# EAGLE design BSB-LAN-Full (EAGLE 6.6.0)
REVISION: v1.1

## Sheet 1 of 4
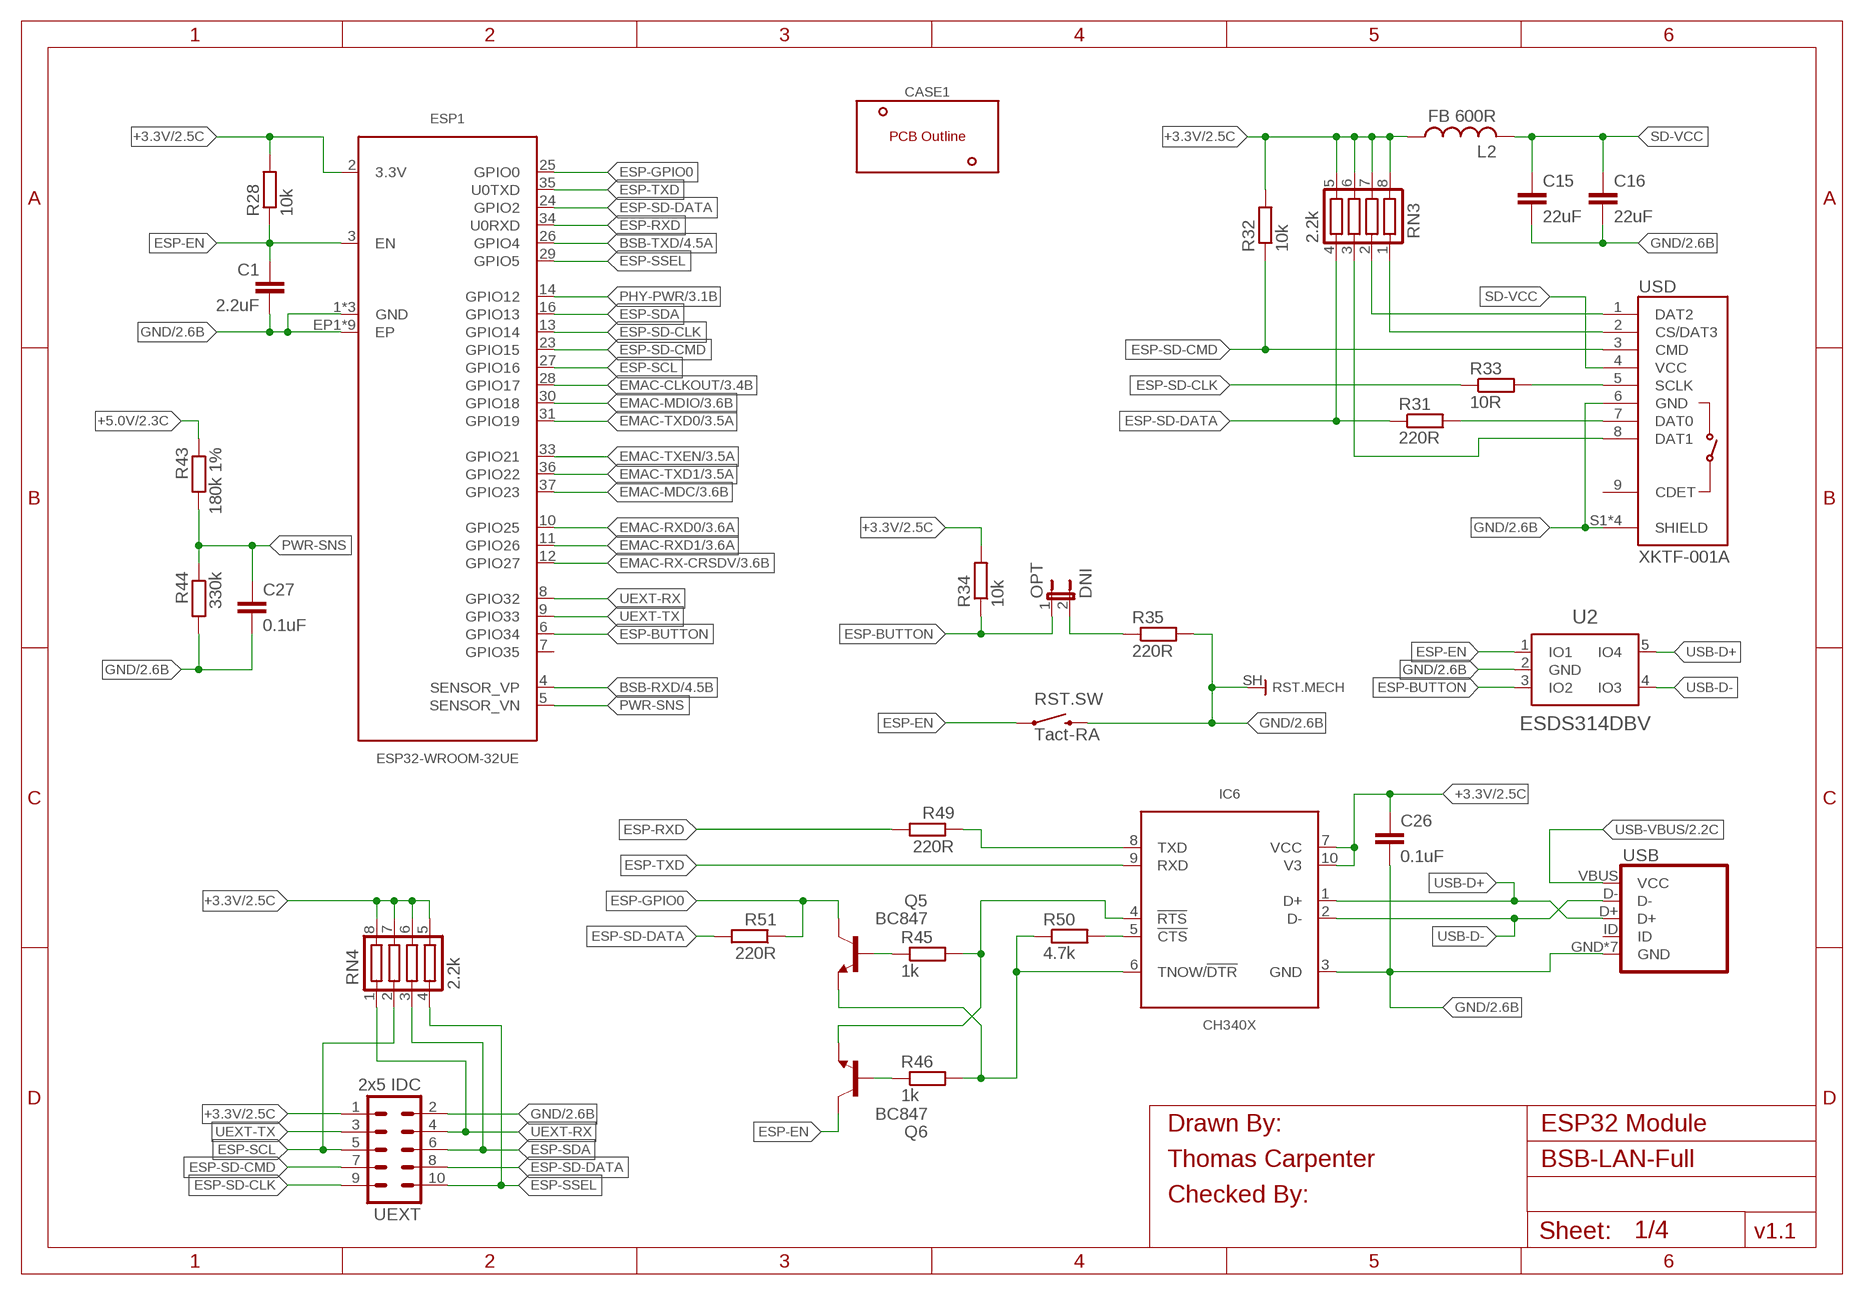
[diagram p0: schematic, sheet 1]
FRAME4 (A4L-LOC): DRAWN_BY: Thomas Carpenter; SHEET_NAME: ESP32 Module

### Parts
C1  2.2uF  C-EUC0603  [C0603]
C15  22uF  C-EUC0805L  [C0805L]
C16  22uF  C-EUC0805L  [C0805L]
C26  0.1uF  C-EUC0603L  [C0603L]
C27  0.1uF  C-EUC0603L  [C0603L]
CASE1  DNI  CNMB/2  [CNMB/2-]
ESP1  ESP32-WROOM-32UE  [ESP32-WROOM-32UE]
IC6  CH340X  [MSOP10]
L2  FB 600R  L-USL0805  [L2010]
OPT  DNI  JUMPER-2-2MM  [1X02-2MM]
Q5  BC847  [SOT23]
Q6  BC847  [SOT23]
R28  10k  R-EU_R0402  [R0402]
R31  220R  R-EU_R0402  [R0402]
R32  10k  R-EU_R0402  [R0402]
R33  10R  R-EU_R0603L  [R0603L]
R34  10k  R-EU_R0402  [R0402]
R35  220R  R-EU_R0402  [R0402]
R43  180k 1%  R-EU_R0402  [R0402]
R44  330k  R-EU_R0603L  [R0603L]
R45  1k  R-EU_R0402  [R0402]
R46  1k  R-EU_R0402  [R0402]
R49  220R  R-EU_R0402  [R0402]
R50  4.7k  R-EU_R0402  [R0402]
R51  220R  R-EU_R0402  [R0402]
RN3  2.2k  R-NET-04-R1206  [CTS742C083]
RN4  2.2k  R-NET-04-R1206  [CTS742C083]
RST  Tact-RA  SWITCH-MOMENTARY-SHELL-SMD-RA  [TACTILE_SWITCH_SMD_SIDE_SHL]
U2  ESDS314DBV  [DBV0005A-SOT23]
UEXT  2x5 IDC  ML10  [ML10]
USB  ZX62-B-5PA(33)  USB_MICROB_PLUG  [USB-MICROB]
USD  XKTF-001A  MICROSD  [MICRO-SD]

### Nets
+3.3V [ESP32]: C26.1 ESP1.2(3.3V) IC6.7(VCC) IC6.10(V3) L2.1 R28.2 R32.2 R34.2 RN3.5 RN3.6 RN3.7 RN3.8 RN4.5 RN4.6 RN4.7 RN4.8 UEXT.1 ; also sheet 2,3,4
+5.0V [ESP32]: R43.1 ; also sheet 2
BSB-RXD [ESP32]: ESP1.4(SENSOR_VP) ; also sheet 4
BSB-TXD [ESP32]: ESP1.26(GPIO4) ; also sheet 4
CH340-!CTS [ESP32]: IC6.5(!CTS) R50.2
CH340-!DTR [ESP32]: IC6.6(TNOW/!DTR) Q5.2(E) R46.2 R50.1
CH340-!RTS [ESP32]: IC6.4(!RTS) Q6.2(E) R45.2
CH340-TXD [ESP32]: IC6.8(TXD) R49.1
EMAC-CLKOUT [ESP32]: ESP1.28(GPIO17) ; also sheet 3
EMAC-MDC [ESP32]: ESP1.37(GPIO23) ; also sheet 3
EMAC-MDIO [ESP32]: ESP1.30(GPIO18) ; also sheet 3
EMAC-RX-CRSDV [ESP32]: ESP1.12(GPIO27) ; also sheet 3
EMAC-RXD0 [ESP32]: ESP1.10(GPIO25) ; also sheet 3
EMAC-RXD1 [ESP32]: ESP1.11(GPIO26) ; also sheet 3
EMAC-TXD0 [ESP32]: ESP1.31(GPIO19) ; also sheet 3
EMAC-TXD1 [ESP32]: ESP1.36(GPIO22) ; also sheet 3
EMAC-TXEN [ESP32]: ESP1.33(GPIO21) ; also sheet 3
ESP-BUTTON [ESP32]: ESP1.6(GPIO34) OPT.1 R34.1 U2.3(IO2)
ESP-BUTTON-R [ESP32]: OPT.2 R35.1
ESP-EN [ESP32]: C1.1 ESP1.3(EN) Q6.3(C) R28.1 RST.1 RST.2 U2.1(IO1)
ESP-GPIO0 [ESP32]: ESP1.25(GPIO0) Q5.3(C) R51.1
ESP-RXD [ESP32]: ESP1.34(U0RXD) R49.2
ESP-SCL [ESP32]: ESP1.27(GPIO16) RN4.2 UEXT.5
ESP-SD-CLK [ESP32]: ESP1.13(GPIO14) R33.1 UEXT.9
ESP-SD-CMD [ESP32]: ESP1.23(GPIO15) R32.1 UEXT.7 USD.3(CMD)
ESP-SD-DATA [ESP32]: ESP1.24(GPIO2) R31.1 R51.2 RN3.4 UEXT.8
ESP-SDA [ESP32]: ESP1.16(GPIO13) RN4.3 UEXT.6
ESP-SSEL [ESP32]: ESP1.29(GPIO5) RN4.4 UEXT.10
ESP-TXD [ESP32]: ESP1.35(U0TXD) IC6.9(RXD)
GND [ESP32]: C1.2 C15.2 C16.2 C26.2 C27.2 ESP1.1(GND) ESP1.15(GND) ESP1.38(GND) ESP1.EP1(EP) ESP1.EP2(EP) ESP1.EP3(EP) ESP1.EP4(EP) ESP1.EP5(EP) ESP1.EP6(EP) ESP1.EP7(EP) ESP1.EP8(EP) ESP1.EP9(EP) IC6.3(GND) R35.2 R44.2 RST.3 RST.4 RST.SH(.MECH:M) U2.2(GND) UEXT.2 USB.GND USB.MT1(GND) USB.MT2(GND) USB.MT3(GND) USB.MT4(GND) USB.MT5(GND) USB.MT6(GND) USD.6(GND) USD.S1(SHIELD) USD.S2(SHIELD) USD.S3(SHIELD) USD.S4(SHIELD) ; also sheet 2,3,4
N$2 [ESP32]: Q5.1(B) R45.1
N$4 [ESP32]: Q6.1(B) R46.1
PHY-PWR [ESP32]: ESP1.14(GPIO12) ; also sheet 3
PWR-SNS [ESP32]: C27.1 ESP1.5(SENSOR_VN) R43.2 R44.1
SD-DAT0 [ESP32]: R31.2 USD.7(DAT0)
SD-DAT1 [ESP32]: RN3.3 USD.8(DAT1)
SD-DAT2 [ESP32]: RN3.2 USD.1(DAT2)
SD-DAT3 [ESP32]: RN3.1 USD.2(CS/DAT3)
SD-SCLK [ESP32]: R33.2 USD.5(SCLK)
SD-VCC [ESP32]: C15.1 C16.1 L2.2 USD.4(VCC)
UEXT-RX: ESP1.8(GPIO32) RN4.1 UEXT.4
UEXT-TX [ESP32]: ESP1.9(GPIO33) UEXT.3
USB-D+ [ESP32]: IC6.1(D+) U2.5(IO4) USB.D+
USB-D- [ESP32]: IC6.2(D-) U2.4(IO3) USB.D-
USB-VBUS [ESP32]: USB.VBUS(VCC) ; also sheet 2
Unconnected: ESP1.7(GPIO35) USB.ID USD.9(CDET)

## Sheet 2 of 4
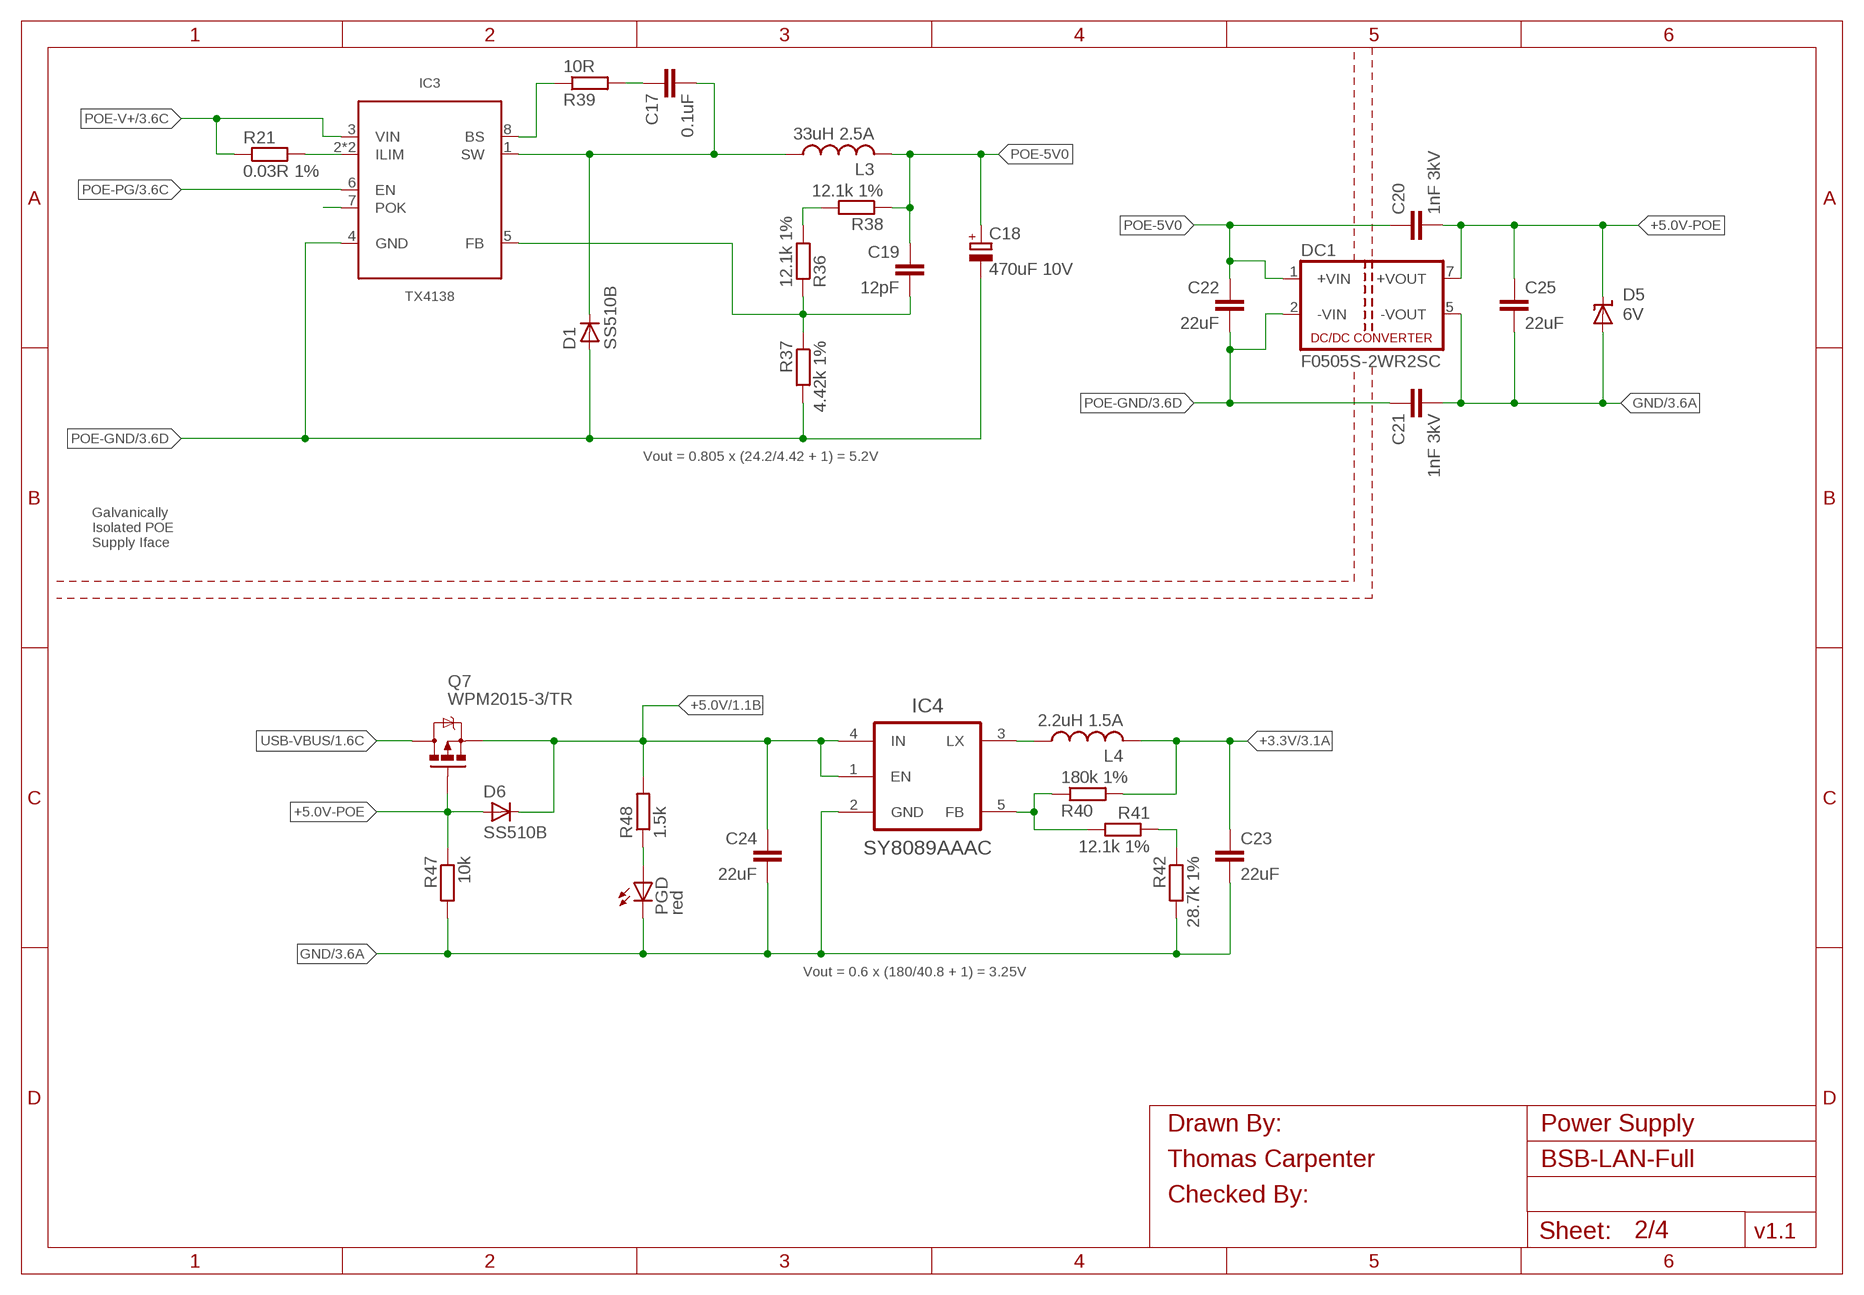
[diagram p1: schematic, sheet 2]
FRAME3 (A4L-LOC): DRAWN_BY: Thomas Carpenter; SHEET_NAME: Power Supply

### Parts
C17  0.1uF  C-EUC0603L  [C0603L]
C18  470uF 10V  CPOL-EUSMCD  [SMC_D]
C19  12pF  C-EUC0402  [C0402]
C20  1nF 3kV  C-EUC1808  [C1808]
C21  1nF 3kV  C-EUC1808  [C1808]
C22  22uF  C-EUC0805  [C0805]
C23  22uF  C-EUC0805  [C0805]
C24  22uF  C-EUC0805  [C0805]
C25  22uF  C-EUC0805  [C0805]
D1  SS510B  DIODE-SMB  [SMB]
D5  6V  TVS-UNISMA  [SMA]
D6  SS510B  DIODE-SMB  [SMB]
DC1  F0505S-2WR2SC  [SIP7-N]
IC3  TX4138  [SOIC8-EP]
IC4  SY8089AAAC  [DBV0005A-SOT23]
L3  33uH 2.5A  L-USL6560P  [L6560P]
L4  2.2uH 1.5A  L-USL4040P  [L4040P]
PGD  red  LEDCHIPLED_0603  [CHIP-LED0603]
Q7  WPM2015-3/TR  [SOT23]
R21  0.03R 1%  R-EU_R1206  [R1206]
R36  12.1k 1%  R-EU_R0402  [R0402]
R37  4.42k 1%  R-EU_R0402  [R0402]
R38  12.1k 1%  R-EU_R0402  [R0402]
R39  10R  R-EU_R0603L  [R0603L]
R40  180k 1%  R-EU_R0402  [R0402]
R41  12.1k 1%  R-EU_R0402  [R0402]
R42  28.7k 1%  R-EU_R0402  [R0402]
R47  10k  R-EU_R0402  [R0402]
R48  1.5k  R-EU_R0603  [R0603]

### Nets
3V3-FB [ESP32]: IC4.5(FB) R40.1 R41.2
3V3-FB-RB [ESP32]: R41.1 R42.1
3V3-LX [ESP32]: IC4.3(LX) L4.1
+3.3V [ESP32]: C23.1 L4.2 R40.2 ; also sheet 1,3,4
+5.0V [ESP32]: C24.1 D6.C IC4.1(EN) IC4.4(IN) Q7.2(S) R48.2 ; also sheet 1
+5.0V-POE [ESP32]: C20.2 C25.1 D5.C D6.A DC1.7(+VOUT) Q7.1(G) R47.1
GND [ESP32]: C21.2 C23.2 C24.2 C25.2 D5.A DC1.5(-VOUT) IC4.2(GND) PGD.C R42.2 R47.2 ; also sheet 1,3,4
POE-5V0 [PoE-ISO]: C18.+ C19.1 C20.1 C22.1 DC1.1(+VIN) L3.2 R38.1
POE-DC-BS [PoE-ISO]: IC3.8(BS) R39.1
POE-DC-BS-RC [PoE-ISO]: C17.1 R39.2
POE-DC-FB [PoE-ISO]: C19.2 IC3.5(FB) R36.1 R37.1
POE-DC-FBRT [PoE-ISO]: R36.2 R38.2
POE-DC-ILIM [PoE-ISO]: IC3.2(ILIM) IC3.EP(ILIM) R21.2
POE-DC-POK-NC [PoE-ISO]: IC3.7(POK)
POE-DC-SW [PoE-ISO]: C17.2 D1.C IC3.1(SW) L3.1
POE-GND [PoE-ISO]: C18.- C21.1 C22.2 D1.A DC1.2(-VIN) IC3.4(GND) R37.2 ; also sheet 3
POE-PG [PoE-ISO]: IC3.6(EN) ; also sheet 3
POE-V+ [PoE-ISO]: IC3.3(VIN) R21.1 ; also sheet 3
PWR-LED [ESP32]: PGD.A R48.1
USB-VBUS [ESP32]: Q7.3(D) ; also sheet 1

### Notes on the sheet
- Vout = 0.805 x (24.2/4.42 + 1) = 5.2V
- Galvanically
  Isolated POE
  Supply Iface
- Vout = 0.6 x (180/40.8 + 1) = 3.25V

## Sheet 3 of 4
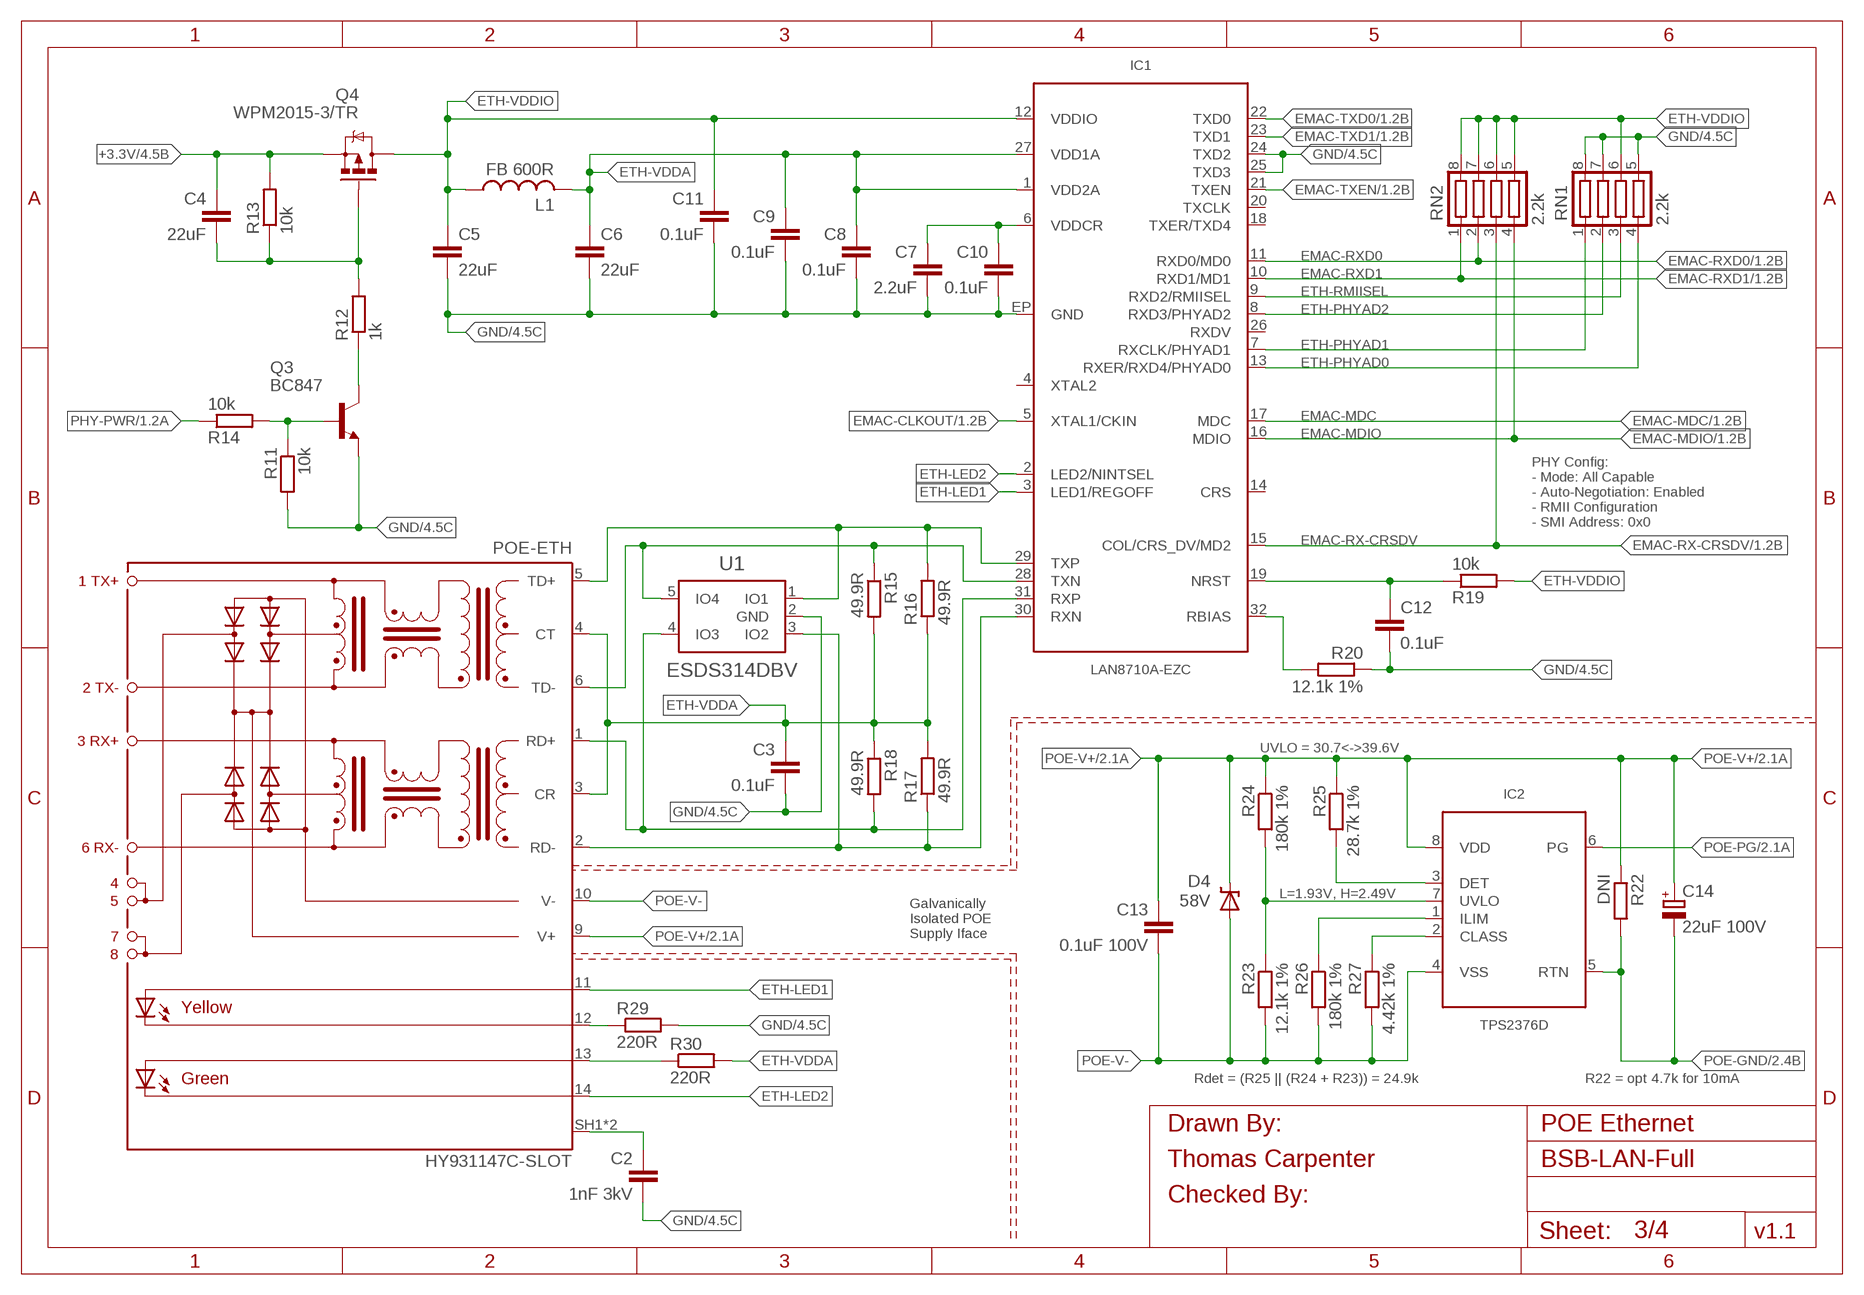
[diagram p2: schematic, sheet 3]
FRAME2 (A4L-LOC): DRAWN_BY: Thomas Carpenter; SHEET_NAME: POE Ethernet

### Parts
C2  1nF 3kV  C-EUC1808  [C1808]
C3  0.1uF  C-EUC0603  [C0603]
C4  22uF  C-EUC0805L  [C0805L]
C5  22uF  C-EUC0805L  [C0805L]
C6  22uF  C-EUC0805L  [C0805L]
C7  2.2uF  C-EUC0603  [C0603]
C8  0.1uF  C-EUC0603L  [C0603L]
C9  0.1uF  C-EUC0603L  [C0603L]
C10  0.1uF  C-EUC0603L  [C0603L]
C11  0.1uF  C-EUC0603L  [C0603L]
C12  0.1uF  C-EUC0603L  [C0603L]
C13  0.1uF 100V  C-EUC0603  [C0603]
C14  22uF 100V  CPOL-EUD  [PANASONIC_D]
D4  58V  TVS-UNISMA  [SMA]
IC1  LAN8710A-EZC  [QFN-5X5-32]
IC2  TPS2376D  [SOIC8]
L1  FB 600R  L-USL0805  [L2010]
POE-ETH  HY931147C-SLOT  [HY931147C-SLOT]
Q3  BC847  [SOT23]
Q4  WPM2015-3/TR  [SOT23]
R11  10k  R-EU_R0402  [R0402]
R12  1k  R-EU_R0402  [R0402]
R13  10k  R-EU_R0402  [R0402]
R14  10k  R-EU_R0402  [R0402]
R15  49.9R  R-EU_R0402L  [R0402L]
R16  49.9R  R-EU_R0402L  [R0402L]
R17  49.9R  R-EU_R0402L  [R0402L]
R18  49.9R  R-EU_R0402L  [R0402L]
R19  10k  R-EU_R0402  [R0402]
R20  12.1k 1%  R-EU_R0402  [R0402]
R22  DNI  R-EU_R1206  [R1206]
R23  12.1k 1%  R-EU_R0402  [R0402]
R24  180k 1%  R-EU_R0402  [R0402]
R25  28.7k 1%  R-EU_R0402  [R0402]
R26  180k 1%  R-EU_R0402  [R0402]
R27  4.42k 1%  R-EU_R0402  [R0402]
R29  220R  R-EU_R0402  [R0402]
R30  220R  R-EU_R0402  [R0402]
RN1  2.2k  R-NET-04-R1206  [CTS742C083]
RN2  2.2k  R-NET-04-R1206  [CTS742C083]
U1  ESDS314DBV  [DBV0005A-SOT23]

### Nets
+3.3V [ESP32]: C4.1 Q4.2(S) R13.2 ; also sheet 1,2,4
EMAC-CLKOUT [ESP32]: IC1.5(XTAL1/CKIN) ; also sheet 1
EMAC-MDC [ESP32]: IC1.17(MDC) ; also sheet 1
EMAC-MDIO [ESP32]: IC1.16(MDIO) RN2.4 ; also sheet 1
EMAC-RX-CRSDV [ESP32]: IC1.15(COL/CRS_DV/MD2) RN2.3 ; also sheet 1
EMAC-RXD0 [ESP32]: IC1.11(RXD0/MD0) RN2.2 ; also sheet 1
EMAC-RXD1 [ESP32]: IC1.10(RXD1/MD1) RN2.1 ; also sheet 1
EMAC-TXD0 [ESP32]: IC1.22(TXD0) ; also sheet 1
EMAC-TXD1 [ESP32]: IC1.23(TXD1) ; also sheet 1
EMAC-TXEN [ESP32]: IC1.21(TXEN) ; also sheet 1
ETH-LED1 [ESP32]: IC1.3(LED1/REGOFF) POE-ETH.11(YA)
ETH-LED1-K [ESP32]: POE-ETH.12(YK) R29.1
ETH-LED2 [ESP32]: IC1.2(LED2/NINTSEL) POE-ETH.14(GK)
ETH-LED-G-A [ESP32]: POE-ETH.13(GA) R30.1
ETH-PHYAD0 [ESP32]: IC1.13(RXER/RXD4/PHYAD0) RN1.4
ETH-PHYAD1 [ESP32]: IC1.7(RXCLK/PHYAD1) RN1.1
ETH-PHYAD2 [ESP32]: IC1.8(RXD3/PHYAD2) RN1.2
ETH-PWR-B [ESP32]: Q3.1(B) R11.1 R14.2
ETH-PWR-C [ESP32]: Q3.3(C) R12.1
ETH-PWR-G [ESP32]: C4.2 Q4.1(G) R12.2 R13.1
ETH-RBIAS [ESP32]: IC1.32(RBIAS) R20.2
ETH-RD_N [100R]: IC1.30(RXN) POE-ETH.2(RD-) R17.1 U1.3(IO2)
ETH-RD_P [100R]: IC1.31(RXP) POE-ETH.1(RD+) R18.2 U1.4(IO3)
ETH-RMIISEL [ESP32]: IC1.9(RXD2/RMIISEL) RN1.3
ETH-RST [ESP32]: C12.1 IC1.19(NRST) R19.1
ETH-SHLD [Sheild]: C2.1 POE-ETH.SH1(SLD) POE-ETH.SH2(SLD)
ETH-TD_N [100R]: IC1.28(TXN) POE-ETH.6(TD-) R15.1 U1.5(IO4)
ETH-TD_P [100R]: IC1.29(TXP) POE-ETH.5(TD+) R16.2 U1.1(IO1)
ETH-VDDA [ESP32]: C3.1 C6.1 C8.1 C9.1 IC1.1(VDD2A) IC1.27(VDD1A) L1.2 POE-ETH.3(CR) POE-ETH.4(CT) R15.2 R16.1 R17.2 R18.1 R30.2
ETH-VDDCR [ESP32]: C7.1 C10.1 IC1.6(VDDCR)
ETH-VDDIO [ESP32]: C5.1 C11.1 IC1.12(VDDIO) L1.1 Q4.3(D) R19.2 RN1.6 RN2.5 RN2.6 RN2.7 RN2.8
GND [ESP32]: C2.2 C3.2 C5.2 C6.2 C7.2 C8.2 C9.2 C10.2 C11.2 C12.2 IC1.24(TXD2) IC1.25(TXD3) IC1.EP(GND) Q3.2(E) R11.2 R20.1 R29.2 RN1.5 RN1.7 RN1.8 U1.2(GND) ; also sheet 1,2,4
PHY-PWR [ESP32]: R14.1 ; also sheet 1
POE-CLASS [PoE-ISO]: IC2.2(CLASS) R27.1
POE-DET [PoE-ISO]: IC2.3(DET) R25.2
POE-GND [PoE-ISO]: C14.- IC2.5(RTN) R22.2 ; also sheet 2
POE-ILIM [PoE-ISO]: IC2.1(ILIM) R26.1
POE-PG [PoE-ISO]: IC2.6(PG) ; also sheet 2
POE-UVLO [PoE-ISO]: IC2.7(UVLO) R23.1 R24.2
POE-V+ [PoE-ISO]: C13.1 C14.+ D4.C IC2.8(VDD) POE-ETH.9(V+) R22.1 R24.1 R25.1 ; also sheet 2
POE-V- [PoE-ISO]: C13.2 D4.A IC2.4(VSS) POE-ETH.10(V-) R23.2 R26.2 R27.2
Unconnected: IC1.4(XTAL2) IC1.14(CRS) IC1.18(TXER/TXD4) IC1.20(TXCLK) IC1.26(RXDV)

### Notes on the sheet
- PHY Config:
  - Mode: All Capable
  - Auto-Negotiation: Enabled
  - RMII Configuration
  - SMI Address: 0x0
- UVLO = 30.7<->39.6V
- L=1.93V, H=2.49V
- Galvanically
  Isolated POE
  Supply Iface
- Rdet = (R25 || (R24 + R23)) = 24.9k | R22 = opt 4.7k for 10mA

## Sheet 4 of 4
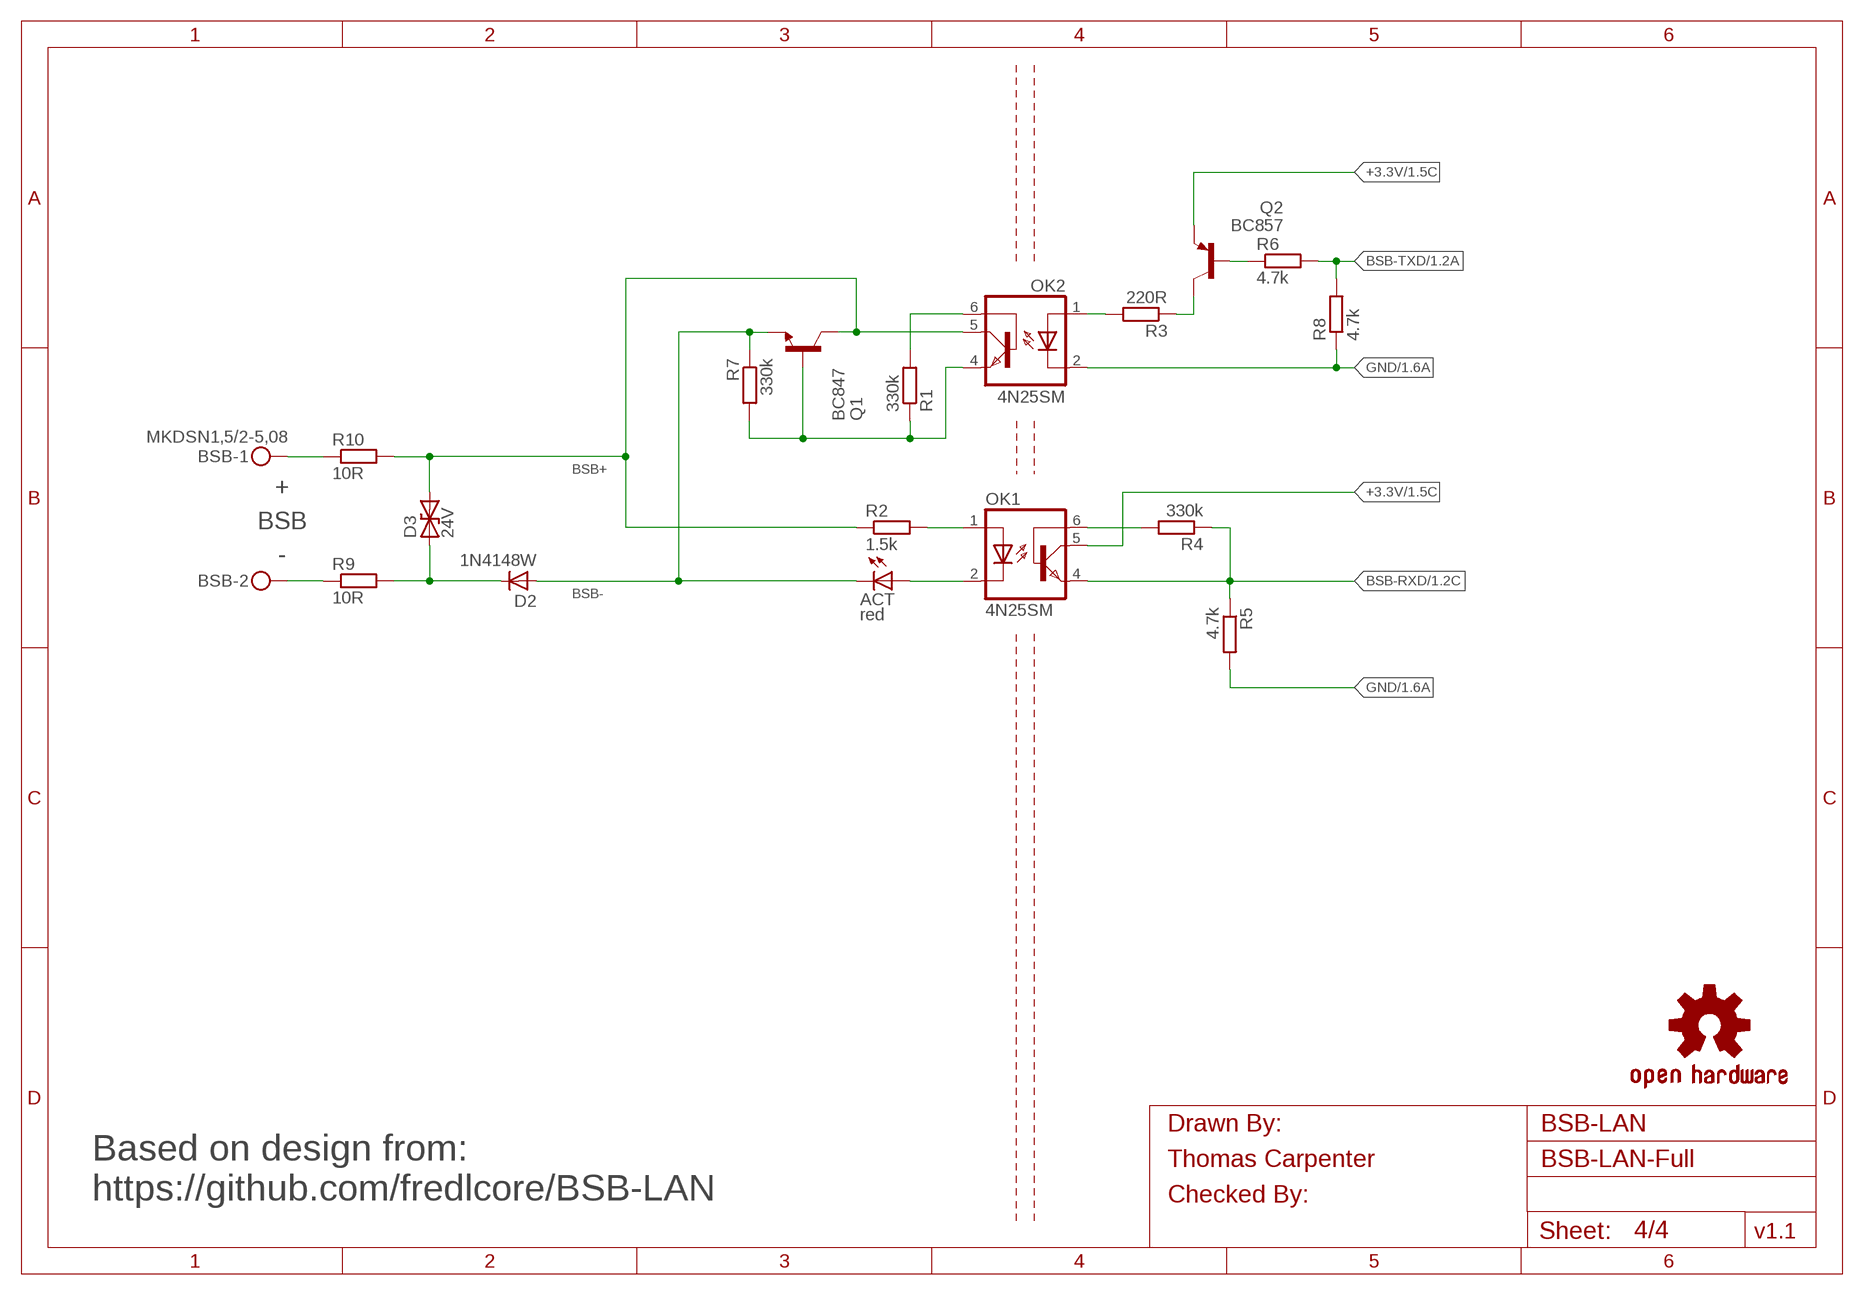
[diagram p3: schematic, sheet 4]
FRAME1 (A4L-LOC): DRAWN_BY: Thomas Carpenter; SHEET_NAME: BSB-LAN

### Parts
ACT  red  LEDCHIPLED_0603  [CHIP-LED0603]
BSB  MKDSN1,5/2-5,08  [MKDSN1_5-2-5_08]
D2  1N4148W  DIODE-SOD123  [SOD123]
D3  24V  TVS-BIDIRSMB  [SMBG]
OK1  4N25SM  [DIL6-SMD]
OK2  4N25SM  [DIL6-SMD]
Q1  BC847  [SOT23]
Q2  BC857  [SOT23-BEC]
R1  330k  R-EU_R0603  [R0603]
R2  1.5k  R-EU_R0603  [R0603]
R3  220R  R-EU_R0402  [R0402]
R4  330k  R-EU_R0603  [R0603]
R5  4.7k  R-EU_R0402  [R0402]
R6  4.7k  R-EU_R0402  [R0402]
R7  330k  R-EU_R0603  [R0603]
R8  4.7k  R-EU_R0402  [R0402]
R9  10R  R-EU_R0603  [R0603]
R10  10R  R-EU_R0603  [R0603]
U$3  DNI  OSHW-LOGOM  [OSHW-LOGO-M]

### Nets
+3.3V [ESP32]: OK1.5(COL) Q2.E ; also sheet 1,2,3
BSB+ [B2B-ISO]: D3.2 OK2.5(COL) Q1.3(C) R2.1 R10.2
BSB- [B2B-ISO]: ACT.C D2.A Q1.2(E) R7.1
BSB-RX-A [B2B-ISO]: OK1.1(A) R2.2
BSB-RX-K [B2B-ISO]: ACT.A OK1.2(C)
BSB-RXD [ESP32]: OK1.4(EMI) R4.1 R5.1 ; also sheet 1
BSB-TX-B [B2B-ISO]: OK2.6(BAS) R1.2
BSB-TX-E [B2B-ISO]: OK2.4(EMI) Q1.1(B) R1.1 R7.2
BSB-TXD [ESP32]: R6.2 R8.2 ; also sheet 1
CON-BSB+ [B2B-ISO]: BSB.1 R10.1
CON-BSB- [B2B-ISO]: BSB.2 R9.1
GND [ESP32]: OK2.2(C) R5.2 R8.1 ; also sheet 1,2,3
RXD-B [ESP32]: OK1.6(BAS) R4.2
TVS-BSB- [B2B-ISO]: D2.C D3.1 R9.2
TXD-A [ESP32]: OK2.1(A) R3.2
TXD-B [ESP32]: Q2.B R6.1
TXD-C [ESP32]: Q2.C R3.1

### Notes on the sheet
- +
  BSB
  -
- Based on design from:
  https://github.com/fredlcore/BSB-LAN

## Library data of the parts
ACT PGD = BSB-LAN:LED: LED OSRAM: - CHIPLED LG R971, LG N971, LY N971, LG Q971, LY Q971, LO R971, LY R971 LH N974, LH R974 LS Q976, LO Q976, LY Q976 LO Q996 - Hyper CHIPLED LW Q18S LB Q993, LB Q99A, LB R99A - SideLED LS A670, LO A670, LY A670, LG A670, LP A670 LB A673, LV A673, LT A673, LW A673 LH A674 LY A675 LS A676, LA A676, LO A676, LY A676, LW A676 LS A679, LY A679, LG A679 - Hyper Micro SIDELED® LS Y876, LA Y876, LO Y876, LY Y876 LT Y87S - SmartLED LW L88C, LW L88S LB L89C, LB L89S, LG L890 LS L89K, LO L89K, LY L89K LS L896, LA L896, LO L896, LY L896 - TOPLED LS T670, LO T670, LY T670, LG T670, LP T670 LSG T670, LSP T670, LSY T670, LOP T670, LYG T670 LG T671, LOG T671, LSG T671 LB T673, LV T673, LT T673, LW T673 LH T674 LS T676, LA T676, LO T676, LY T676, LB T676, LH T676, LSB T676, LW T676 LB T67C, LV T67C, LT T67C, LS T67K, LO T67K, LY T67K, LW E67C LS E67B, LA E67B, LO E67B, LY E67B, LB E67C, LV E67C, LT E67C LW T67C LS T679, LY T679, LG T679 LS T770, LO T770, LY T770, LG T770, LP T770 LB T773, LV T773, LT T773, LW T773 LH T774 LS E675, LA E675, LY E675, LS T675 LS T776, LA T776, LO T776, LY T776, LB T776 LHGB T686 LT T68C, LB T68C - Hyper Mini TOPLED® LB M676 - Mini TOPLED Santana® LG M470 LS M47K, LO M47K, LY M47K Source: http://www.osram.convergy.de LUXEON: - LUMILED® LXK2-PW12-R00, LXK2-PW12-S00, LXK2-PW14-U00, LXK2-PW14-V00 LXK2-PM12-R00, LXK2-PM12-S00, LXK2-PM14-U00 LXK2-PE12-Q00, LXK2-PE12-R00, LXK2-PE12-S00, LXK2-PE14-T00, LXK2-PE14-U00 LXK2-PB12-K00, LXK2-PB12-L00, LXK2-PB12-M00, LXK2-PB14-N00, LXK2-PB14-P00, LXK2-PB14-Q00 LXK2-PR12-L00, LXK2-PR12-M00, LXK2-PR14-Q00, LXK2-PR14-R00 LXK2-PD12-Q00, LXK2-PD12-R00, LXK2-PD12-S00 LXK2-PH12-R00, LXK2-PH12-S00 LXK2-PL12-P00, LXK2-PL12-Q00, LXK2-PL12-R00 Source: www.luxeon.com KINGBRIGHT: KA-3528ASYC Source: www.kingbright.com; JLC_ROT: 270; LCSC_PART: C2286
BSB = BSB-LAN:MKDSN1,5/2-5,08: MKDSN 1,5/ 2-5,08 Printklemme Nennstrom: 13,5 A Nennspannung: 250 V Rastermaß: 5,08 mm Polzahl: 2 Anschlussart: Schraubanschluss Montage: Löten Anschlussrichtung Leiter/Platine: 0 ° Artikelnummer: 1729128 Source: http://eshop.phoenixcontact.com .. 1729128.pdf; LCSC_PART: C5183989
C1 C7 = BSB-LAN:C-EU: CAPACITOR, European symbol; LCSC_PART: C23630
C2 C20 C21 = BSB-LAN:C-EU: CAPACITOR, European symbol; LCSC_PART: C577300
C3 C8-C13 C17 C26 C27 = BSB-LAN:C-EU: CAPACITOR, European symbol; LCSC_PART: C113803
C4-C6 C15 C16 C22-C25 = BSB-LAN:C-EU: CAPACITOR, European symbol; LCSC_PART: C45783
C14 = BSB-LAN:CPOL-EU: POLARIZED CAPACITOR, European symbol; LCSC_PART: C487431
C18 = BSB-LAN:CPOL-EU: POLARIZED CAPACITOR, European symbol; LCSC_PART: C4944894
C19 = BSB-LAN:C-EU: CAPACITOR, European symbol; LCSC_PART: C1547
CASE1 = BSB-LAN:CNMB
D1 D6 = BSB-LAN:DIODE-: DIODE; LCSC_PART: C65011
D2 = BSB-LAN:DIODE-: DIODE; LCSC_PART: C81598
D3 = BSB-LAN:TVS-BIDIR: Bidirectional TVS Suppressor Diode SMAJxx(C)A Voltage Suppressor - SMA Package (DO-214AC) SMBJxx(C)A Voltage Suppressor - SMB Package (DO-214AA) SMCJxx(C)A Voltage Suppressor - SMC Package (DO-214AB); LCSC_PART: C83268
D4 = BSB-LAN:TVS-UNI: Suppressor diode; LCSC_PART: C151246
D5 = BSB-LAN:TVS-UNI: Suppressor diode; LCSC_PART: C223993
DC1 = BSB-LAN:F*S-2WR2: DC-DC CONVERTER; LCSC_PART: C909777
ESP1 = BSB-LAN:ESP32-WROOM; JLC_Y: 7.72; LCSC_PART: C701344
IC1 = BSB-LAN:LAN8710A; JLC_ROT: 270; LCSC_PART: C46185
IC2 = BSB-LAN:TPS237*; LCSC_PART: C2859892
IC3 = BSB-LAN:TX4138; LCSC_PART: C329267
IC4 = BSB-LAN:SY8089*?C; JLC_ROT: 270; LCSC_PART: C78988
IC6 = BSB-LAN:CH340X; LCSC_PART: C3035748
L1 L2 = BSB-LAN:L-US: INDUCTOR, American symbol; LCSC_PART: C1017
L3 = BSB-LAN:L-US: INDUCTOR, American symbol; LCSC_PART: C2839927
L4 = BSB-LAN:L-US: INDUCTOR, American symbol; LCSC_PART: C135262
OK1 OK2 = BSB-LAN:4N*?M: General Purpose 6-Pin Phototransistor Optocouplers Source: http://www.fairchildsemi.com/ds/4N/4N35-M.pdf; LCSC_PART: C258246
OPT = BSB-LAN:JUMPER-2: Jumper Basic 0.1" spaced jumper. Use with breakaway headers.
POE-ETH = BSB-LAN:HY931147C: HANRUN HY931147C RJ45 w/ POE Ethernet Jack with magnetics and POE rectifiers. Manufacturer HANRUN(Zhongshan HanRun Elec) MFR.Part # HY931147C; JLC_ROT: 270; JLC_Y: -2.42; LCSC_PART: C91754
Q1 Q3 Q5 Q6 = BSB-LAN:BC847*: NPN Transistor; JLC_ROT: 270; LCSC_PART: C130417
Q2 = BSB-LAN:BC857*: PNP Transistror; JLC_ROT: 270; LCSC_PART: C426782
Q4 Q7 = BSB-LAN:WPM2015; JLC_ROT: 270; LCSC_PART: C7472861
R1 R4 R7 R44 = BSB-LAN:R-EU_: RESISTOR, European symbol; LCSC_PART: C23137
R2 R48 = BSB-LAN:R-EU_: RESISTOR, European symbol; LCSC_PART: C22843
R3 R29-R31 R35 R49 R51 = BSB-LAN:R-EU_: RESISTOR, European symbol; LCSC_PART: C25091
R5 R6 R8 R50 = BSB-LAN:R-EU_: RESISTOR, European symbol; LCSC_PART: C25900
R9 R10 R33 R39 = BSB-LAN:R-EU_: RESISTOR, European symbol; LCSC_PART: C22859
R11 R13 R14 R19 R28 R32 R34 R47 = BSB-LAN:R-EU_: RESISTOR, European symbol; LCSC_PART: C25744
R12 R45 R46 = BSB-LAN:R-EU_: RESISTOR, European symbol; LCSC_PART: C11702
R15-R18 = BSB-LAN:R-EU_: RESISTOR, European symbol; LCSC_PART: C25120
R20 R23 R36 R38 R41 = BSB-LAN:R-EU_: RESISTOR, European symbol; LCSC_PART: C25852
R21 = BSB-LAN:R-EU_: RESISTOR, European symbol; LCSC_PART: C163046
R22 = BSB-LAN:R-EU_: RESISTOR, European symbol
R24 R26 R40 R43 = BSB-LAN:R-EU_: RESISTOR, European symbol; LCSC_PART: C25760
R25 R42 = BSB-LAN:R-EU_: RESISTOR, European symbol; LCSC_PART: C26972
R27 R37 = BSB-LAN:R-EU_: RESISTOR, European symbol; LCSC_PART: C52269
RN1-RN4 = BSB-LAN:R-NET-04: Chip Resistor Array 4 Single Resistor Source: http://www.ctscorp.com/components/Datasheets/CTSChipArrayDs.pdf; JLC_ROT: 270; LCSC_PART: C414564
RST = BSB-LAN:SWITCH-MOMENTARY-SHELL; LCSC_PART: C495926
U1 U2 = BSB-LAN:ESDS314; LCSC_PART: C1847859
U$3 = BSB-LAN:OSHW-LOGO: Open Source Hardware Logo This logo indicates the piece of hardware it is found on incorporates a OSHW license and/or adheres to the definition of open source hardware found here: http://freedomdefined.org/OSHW
UEXT = BSB-LAN:ML10: HARTING; LCSC_PART: C5665
USB = BSB-LAN:USB_MICROB_PLUG; JLC_Y: 1.2; LCSC_PART: C132561
USD = BSB-LAN:MICROSD: microSD Socket Push-push type uSD socket with card detect switch.; JLC_X: 7.28; JLC_Y: -8.1; LCSC_PART: C381079

## Net classes
1 100R: width 0.175 mm, drill 0.25 mm, clearance 0.15 mm
2 PoE-ISO: clearance 2 mm to class 1
3 B2B-ISO: clearance 2 mm to class 1, clearance 2 mm to class 2
4 ESP32: clearance 2 mm to class 2, clearance 2 mm to class 3
5 Sheild: clearance 1.5 mm to class 1, clearance 2 mm to class 2, clearance 2 mm to class 3, clearance 1.5 mm to class 4

## Board
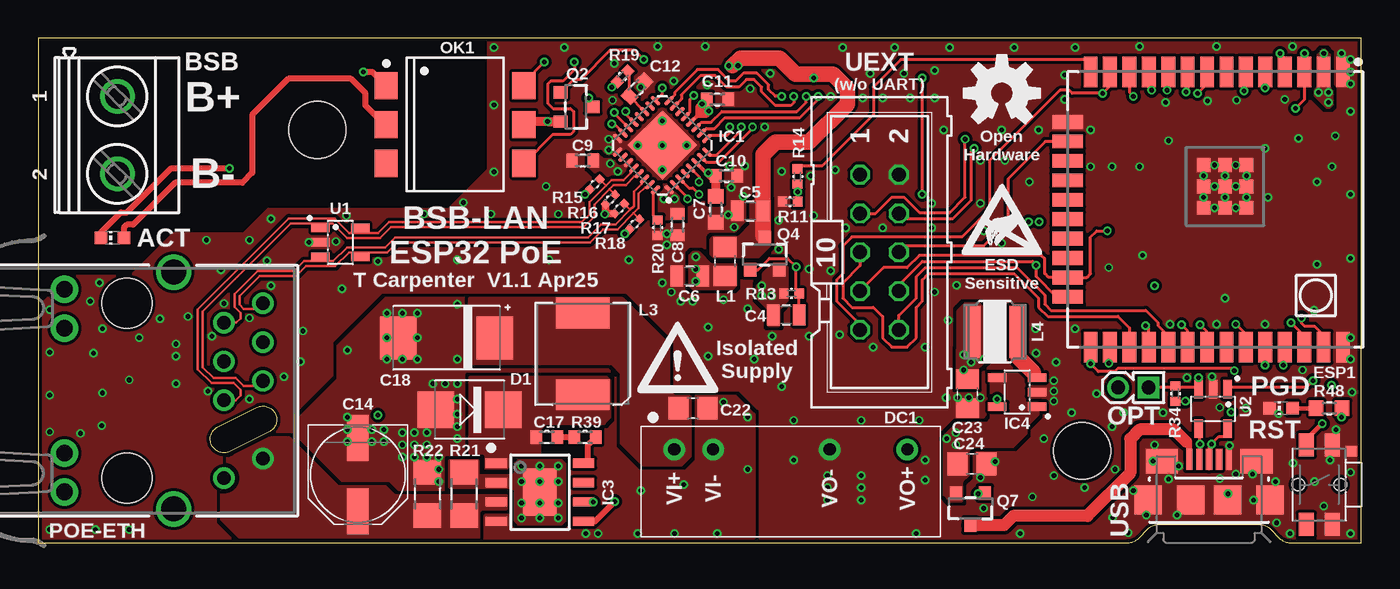
[diagram p4: board, top side]
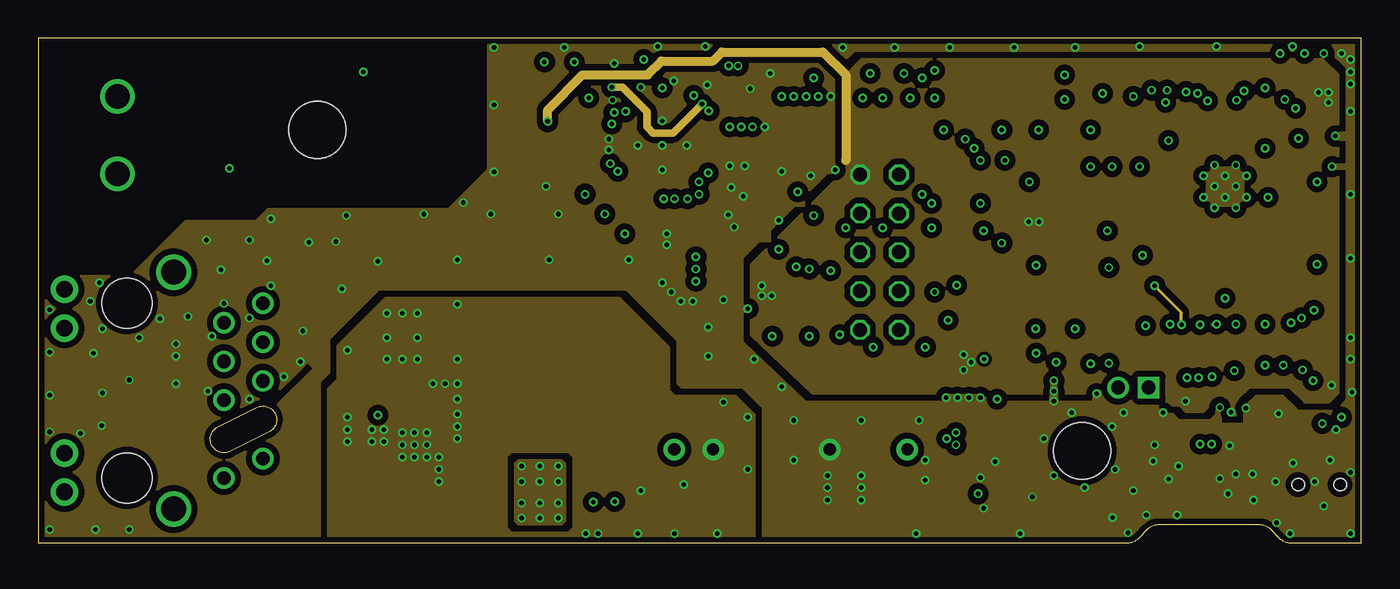
[diagram p5: board, inner layer Route2]
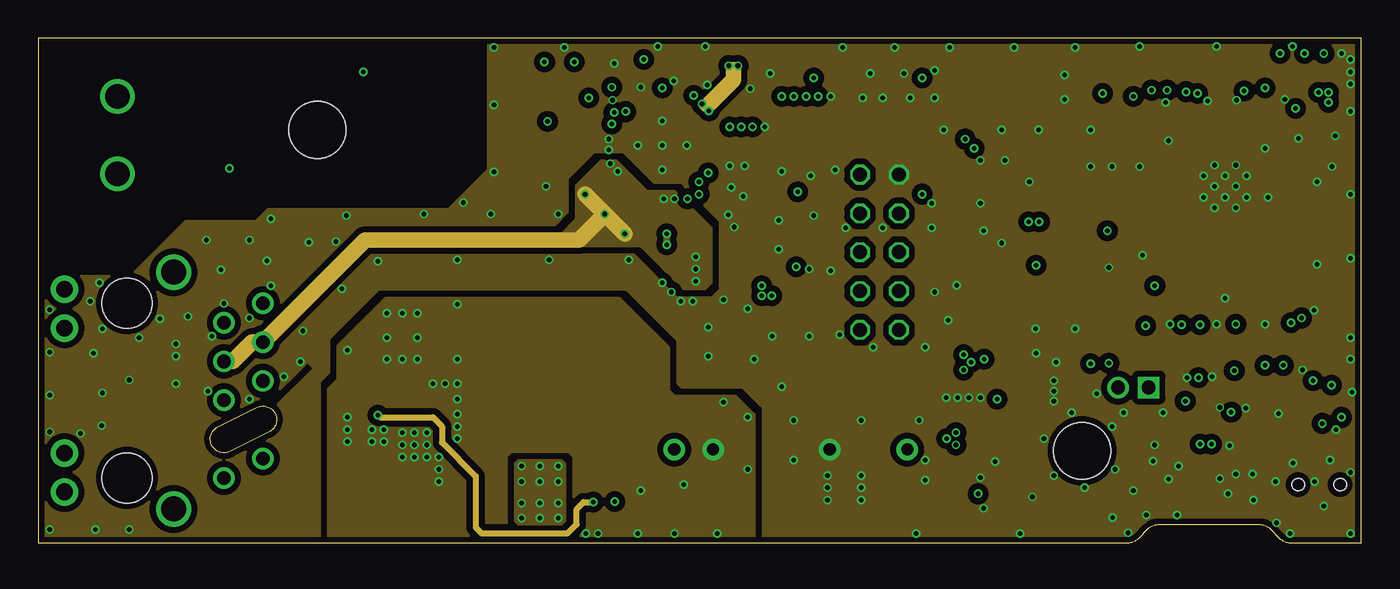
[diagram p6: board, inner layer Route15]
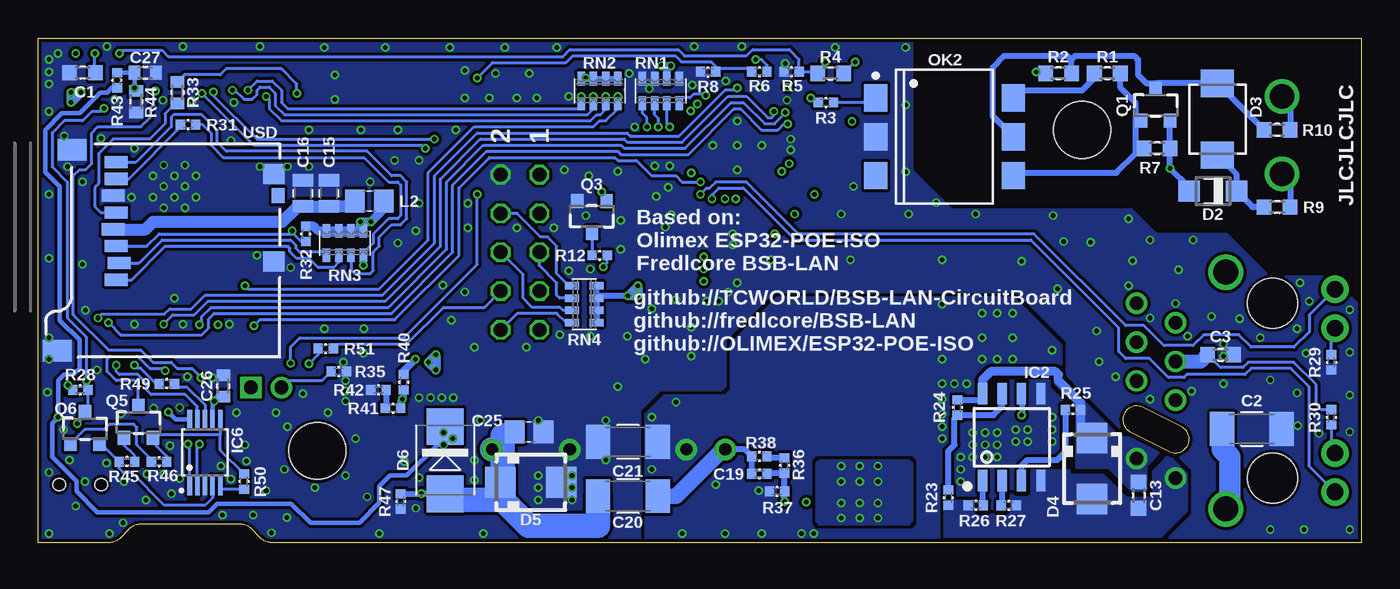
[diagram p7: board, bottom side, seen from below]

Size 86.5 x 33 mm. Coordinates in mm from the lower left corner, seen from the top.
Outline: 0,33 0,0 71.24,0 arc45 71.94,0.29 72.56,0.91 arc-45 73.26,1.2 79.84,1.2 arc-45 80.54,0.91 81.16,0.29 arc45 81.86,0 86.5,0 86.5,33 0,33
Copper layers (1+2*15+16): Top 0.035mm / dielectric 0.2mm / Route2 0.0175mm / dielectric 1.065mm / Route15 0.0175mm / dielectric 0.2mm / Bottom 0.035mm
Design rules "jlc4l-7628 *": minimum track width 0.12mm, minimum drill 0.2mm, track to track 0.125mm, track to pad 0.125mm, pad to pad 0.15mm, via to via 0.125mm, smd to smd 0mil, copper to edge 9mil, drill to drill 0.2mm, minimum pad ring 0.125mm, minimum via ring 0.125mm, stop-mask expansion 0.125mm, vias tented up to drill 1mm, thermal gap 6mil

### Footprints (pad centres in the part's own frame; a part is rotated, then mirrored left to right if it is on the bottom)
CHIP-LED0603 = smd 0.8 x 0.8: A 0,-0.75; C 0,0.75
MKDSN1_5-2-5_08 = drill 1.6: 1 -2.54,0.025; 2 2.54,0.025
C0603 = smd 0.95 x 1: 1 -0.85,0; 2 0.85,0
C1808 = smd 1.6 x 2.2: 1 -1.95,0; 2 1.95,0
C0805L = smd 0.8 x 1.35: 1 -0.85,0; 2 0.85,0
C0603L = smd 0.75 x 0.9: 1 -0.7,0; 2 0.7,0
PANASONIC_D = smd 3 x 1.4: + 2.4,0; - -2.4,0
SMC_D = smd 2.4 x 2.8: + -3.15,0; - 3.15,0
C0402 = smd 0.6 x 0.65: 1 -0.5,0; 2 0.5,0
C0805 = smd 1.3 x 1.5: 1 -0.95,0; 2 0.95,0
CNMB/2- = hole 3.7: 18.25,27; 68.25,6
SMB = smd 2.4 x 2.4: A 2.2,0; C -2.2,0
SOD123 = smd 1.4 x 1.4: A 1.55,0; C -1.55,0
SMBG = smd 1.78 x 2.16: 1 -2.35,0; 2 2.35,0
SMA = smd 2 x 2: A 2,0; C -2,0
SIP7-N = drill 0.8 pad 1.4: 1 -7.62,-0.5; 2 -5.08,-0.5; 5 2.54,-0.5; 7 7.62,-0.5
ESP32-WROOM-32UE = smd 2 x 0.9: 1 -9,16.51; 2 -9,15.24; 3 -9,13.97; 4 -9,12.7; 5 -9,11.43; 6 -9,10.16; 7 -9,8.89; 8 -9,7.62; 9 -9,6.35; 10 -9,5.08; 11 -9,3.81; 12 -9,2.54; 13 -9,1.27; 14 -9,0; 25 9,0; 26 9,1.27; 27 9,2.54; 28 9,3.81; 29 9,5.08; 30 9,6.35; 31 9,7.62; 32 9,8.89; 33 9,10.16; 34 9,11.43; 35 9,12.7; 36 9,13.97; 37 9,15.24; 38 9,16.51 | smd 0.9 x 2: 15 -5.715,-1.5; 16 -4.445,-1.5; 17 -3.175,-1.5; 18 -1.905,-1.5; 19 -0.635,-1.5; 20 0.635,-1.5; 21 1.905,-1.5; 22 3.175,-1.5; 23 4.445,-1.5; 24 5.715,-1.5 | smd 0.9 x 0.9: EP1 -1.5,8.79; EP2 -1.5,10.19; EP3 -0.1,10.19; EP4 -0.1,8.79; EP5 -0.1,7.39; EP6 -1.5,7.39; EP7 -2.9,7.39; EP8 -2.9,8.79; EP9 -2.9,10.19
QFN-5X5-32 = smd 0.75 x 0.25: 1 -2.375,1.75; 2 -2.375,1.25; 3 -2.375,0.75; 4 -2.375,0.25; 5 -2.375,-0.25; 6 -2.375,-0.75; 7 -2.375,-1.25; 8 -2.375,-1.75; 17 2.375,-1.75; 18 2.375,-1.25; 19 2.375,-0.75; 20 2.375,-0.25; 21 2.375,0.25; 22 2.375,0.75; 23 2.375,1.25; 24 2.375,1.75 | smd 0.25 x 0.75: 9 -1.75,-2.375; 10 -1.25,-2.375; 11 -0.75,-2.375; 12 -0.25,-2.375; 13 0.25,-2.375; 14 0.75,-2.375; 15 1.25,-2.375; 16 1.75,-2.375; 25 1.75,2.375; 26 1.25,2.375; 27 0.75,2.375; 28 0.25,2.375; 29 -0.25,2.375; 30 -0.75,2.375; 31 -1.25,2.375; 32 -1.75,2.375 | smd 3.2 x 3.2: EP 0,0
SOIC8 = smd 0.6 x 1.4: 1 -1.905,-2.85; 2 -0.635,-2.85; 3 0.635,-2.85; 4 1.905,-2.85; 5 1.905,2.85; 6 0.635,2.85; 7 -0.635,2.85; 8 -1.905,2.85
SOIC8-EP = smd 0.6 x 1.4: 1 -1.905,-2.85; 2 -0.635,-2.85; 3 0.635,-2.85; 4 1.905,-2.85; 5 1.905,2.85; 6 0.635,2.85; 7 -0.635,2.85; 8 -1.905,2.85 | smd 3.1 x 2.2: EP 0,0
DBV0005A-SOT23 = smd 0.55 x 1.2: 1 -0.95,-1.3; 2 0,-1.3; 3 0.95,-1.3; 4 0.95,1.3; 5 -0.95,1.3
MSOP10 = smd 0.3 x 1.3: 1 -1,-2.15; 2 -0.5,-2.15; 3 0,-2.15; 4 0.5,-2.15; 5 1,-2.15; 6 1,2.15; 7 0.5,2.15; 8 0,2.15; 9 -0.5,2.15; 10 -1,2.15
L2010 = smd 1.3 x 1.5: 1 -0.95,0; 2 0.95,0
L6560P = smd 2 x 3.5: 1 -2.675,0; 2 2.675,0
L4040P = smd 1.1 x 3.4: 1 -1.5,0; 2 1.5,0
DIL6-SMD = smd 1.78 x 1.52: 1 -2.54,-4.5; 2 0,-4.5; 3 2.54,-4.5; 4 2.54,4.5; 5 0,4.5; 6 -2.54,4.5
1X02-2MM = drill 0.9 pad 1.4 square: 1 -1,0 | drill 0.9 pad 1.4: 2 1,0
HY931147C-SLOT = drill 0.89 pad 1.4: 1 5.715,-8.89; 2 4.445,-6.35; 3 3.175,-8.89; 4 1.905,-6.35; 5 0.635,-8.89; 6 -0.635,-6.35; 9 -4.445,-8.89; 10 -5.715,-6.35 | drill 1.1 pad 1.8: 11 6.625,4.08; 12 4.085,4.08; 13 -4.085,4.08; 14 -6.625,4.08 | drill 1.63 pad 2.3: SH1 7.745,-3.05; SH2 -7.745,-3.05 | hole 3.25: -5.715,0; 5.715,0
SOT23 = smd 0.8 x 0.9: 1 -0.95,-1; 2 0.95,-1; 3 0,1.1
SOT23-BEC = smd 0.8 x 0.9: B -0.95,-1; C 0,1.1; E 0.95,-1
R0603 = smd 0.95 x 1: 1 -0.85,0; 2 0.85,0
R0402 = smd 0.6 x 0.65: 1 -0.5,0; 2 0.5,0
R0402L = smd 0.47 x 0.52: 1 -0.45,0; 2 0.45,0
R1206 = smd 1.6 x 1.803: 1 -1.422,0; 2 1.422,0
R0603L = smd 0.75 x 0.9: 1 -0.7,0; 2 0.7,0
CTS742C083 = smd 0.5 x 0.9: 1 -1.2,-0.8; 2 -0.4,-0.8; 3 0.4,-0.8; 4 1.2,-0.8; 5 1.2,0.8; 6 0.4,0.8; 7 -0.4,0.8; 8 -1.2,0.8
TACTILE_SWITCH_SMD_SIDE_SHL = smd 1.5 x 1: 1 -2.6,0.85; 2 2.6,0.85; 3 -2.6,-0.85; 4 2.6,-0.85 | smd 0.7 x 0.75: SH 2.2,-2.1 | hole 0.8: 0,-1.375; 0,1.375
ML10 = drill 0.914 octagon: 1 -5.08,-1.27; 2 -5.08,1.27; 3 -2.54,-1.27; 4 -2.54,1.27; 5 0,-1.27; 6 0,1.27; 7 2.54,-1.27; 8 2.54,1.27; 9 5.08,-1.27; 10 5.08,1.27
USB-MICROB = smd 0.4 x 1.4: D+ 0,2.65; D- -0.65,2.65; GND 1.3,2.65; ID 0.65,2.65; VBUS -1.3,2.65 | smd 1.8 x 1.9: MT1 -4,0; MT2 4,0; MT5 -1.2,0; MT6 1.2,0 | smd 2.1 x 1.6: MT3 -3.1,2.55; MT4 3.1,2.55
MICRO-SD = smd 0.8 x 1.5: 1 5.35,-4.8; 2 6.45,-5; 3 7.55,-4.8; 4 8.65,-4.6; 5 9.75,-4.8; 6 10.85,-4.6; 7 11.95,-4.8; 8 13.05,-4.8 | smd 1 x 0.85: 9 10.86,-15.375 | smd 1.4 x 1.9: S1 0.7,-0.95; S2 13.85,-1.92 | smd 1.3 x 1.4: S3 6.55,-15.1; S4 12.25,-15.1

### Placement (x,y rotation side)
ACT  4.85,19.95 90 top
BSB  5.16,26.66 270 top
C1  83.6,30.75 180 bottom
C2  7.15,7.45 0 bottom
C3  9.2,12.3 0 bottom
C4  48.9,14.9 0 top
C5  46.55,21.7 180 top
C6  42.6,17.45 180 top
C7  44.3,21.8 270 top
C8  41.8,20.8 270 top
C9  35.6,25 180 top
C10  45,24 0 top
C11  44.4,29 0 top
C12  39.15,29.7 45 top
C13  14.55,3.1 270 bottom
C14  20.9,4.45 270 top
C15  67.5,22.85 90 bottom
C16  69.2,22.85 90 bottom
C17  33.25,6.9 180 top
C18  26.7,13.4 180 top
C19  39.35,4.5 0 bottom
C20  47.95,3.05 180 bottom
C21  47.95,6.6 180 bottom
C22  42.8,8.8 0 top
C23  60.75,9.75 270 top
C24  61.05,5.15 0 top
C25  54.4,7.25 0 bottom
C26  74.4,10.25 90 bottom
C27  79.5,30.75 0 bottom
CASE1  0,0 0 top
D1  28.2,8.7 180 top
D2  9.7,23 180 bottom
D3  9.4,27.7 90 bottom
D4  17.6,4.85 270 bottom
D5  54.3,3.95 0 bottom
D6  59.9,5.4 270 bottom
DC1  49.2,6.6 0 top
ESP1  68.8,21.8 270 top
IC1  40.8,26 135 top
IC2  22.85,6.9 0 bottom
IC3  32.8,3.3 270 top
IC4  64,9.85 90 top
IC6  75.6,5.9 0 bottom
L1  44.9,18.4 270 top
L2  64.85,22.35 180 bottom
L3  35.6,12.35 90 top
L4  62.55,13.8 180 top
OK1  27.25,27.35 270 top
OK2  27.25,26.55 270 bottom
OPT  71.6,10.15 180 top
PGD  81.25,8.8 90 top
POE-ETH  5.8,9.95 90 top
Q1  13.45,28.6 0 bottom
Q2  35.15,28.5 270 top
Q3  50.3,21.35 180 bottom
Q4  47.5,18.85 0 top
Q5  79.95,7.85 0 bottom
Q6  83.45,7.45 0 bottom
Q7  60.95,2.25 180 top
R1  16.6,30.7 180 bottom
R2  19.8,30.7 180 bottom
R3  35,28.8 0 bottom
R4  34.7,30.7 0 bottom
R5  37.25,30.8 180 bottom
R6  39.35,30.8 180 bottom
R7  13.35,25.8 180 bottom
R8  42.7,30.8 0 bottom
R9  5.5,21.95 180 bottom
R10  5.5,27 180 bottom
R11  49.15,22.3 180 top
R12  49.8,18.8 0 bottom
R13  49.25,16.3 180 top
R14  49.65,23.95 270 top
R15  36.4,23.45 225 top
R16  37.4,22.45 45 top
R17  38,21.85 225 top
R18  39,20.85 45 top
R19  38.2,30.5 225 top
R20  40.5,20.6 90 top
R21  27.85,3.2 90 top
R22  25.45,3.2 90 top
R23  27,2.95 270 bottom
R24  26.4,8.85 270 bottom
R25  18.85,8.7 180 bottom
R26  25.2,2.45 180 bottom
R27  23.05,2.45 0 bottom
R28  83.75,10 180 bottom
R29  1.95,11.8 270 bottom
R30  1.95,8.2 90 bottom
R31  76.7,27.35 180 bottom
R32  69,20.2 90 bottom
R33  77.4,29.45 270 bottom
R34  74.35,9.75 270 top
R35  66.85,11.2 0 bottom
R36  37.7,5.05 90 bottom
R37  38.2,3.35 180 bottom
R38  39.35,5.65 0 bottom
R39  35.75,6.9 180 top
R40  62.6,10.5 90 bottom
R41  63.3,8.8 0 bottom
R42  64.25,10 180 bottom
R43  81.35,30.25 90 bottom
R44  80.1,28.85 270 bottom
R45  80.7,5.3 180 bottom
R46  78.6,5.3 0 bottom
R47  62.8,2.7 270 bottom
R48  84.4,8.8 0 top
R49  78.1,10.4 180 bottom
R50  73.05,4 270 bottom
R51  67.7,12.7 0 bottom
RN1  45.8,29.55 0 bottom
RN2  49.8,29.55 0 bottom
RN3  66.45,19.6 0 bottom
RN4  50.8,15.6 270 bottom
RST  83.75,3.8 90 top
U1  19.75,19.65 270 top
U2  76.8,8.75 180 top
U$1  [WARN-TINY]  41.8,11.6 0 top
U$2  [ESD-TINY]  63,20.6 0 top
U$3  63,29.4 0 top
UEXT  55,19 270 top
USB  76.55,2.8 0 top
USD  86.2,11.85 90 bottom

### Tracks (layer width: path | path; a pad name or v marks a point on that pad's centre or on a via)
3V3-FB  (via drill 0.3)
  Top 0.4: IC4.5 v62.7,9.4
  Bottom 0.4: R40.1 62.6,9.5 v62.7,9.4 62.8,9.3 R41.2
3V3-FB-RB
  Bottom 0.4: R42.1 63.75,8.8 R41.1
3V3-LX
  Top 0.55: IC4.3 65.3,11.15 65.05,11.15
  Top 1: 65.05,11.15 64.05,12.15 L4.1
+3.3V  (via drill 0.3)
  Top 0.2: R34.2 v75,9.25
  Top 0.6: OK1.5 31.95,27.55 v33.3,27.55 Q2.E
  Route2 0.6: v33.3,27.55 33.3,28.3 35.6,30.6 39.85,30.6 40.75,31.5 44.1,31.5 44.7,32.1 51.3,32.1 52.8,30.6 52.8,25.01
  Bottom 0.3: IC6.7 75.1,9.15 v75,9.25 | v78,8.55 77.5,8.05 IC6.10
  Bottom 0.4: R28.2 v84.55,10.3 | v47.95,16.15 50,16.15 | 50,16.15 RN4.8 | 50,16.15 RN4.7 RN4.6 RN4.5
  Bottom 0.5: v75,9.25 74.7,9.55 C26.1 | R40.2 62.6,11.25 v61.85,12
  Bottom 0.6: L2.1 63.9,21.85 v64.75,21 v65.45,21 65.45,20.4 RN3.5 RN3.6 RN3.7 RN3.8 68.2,20.4 68.5,20.7 R32.2 | v83.7,29.45 v84.35,28.8 v84.35,29.45 v83.7,29.45 | v60.5,12.3 v60.5,11.3 v61,11.8 v60.5,12.3 | v47.95,16.15 v47.3,16.8 v47.3,16.15 v47.95,16.15
  other vias: 84.05,32
  pour Top (isolate 0.2, no thermals): 61.4,10.15 61.4,11.4 62.05,12 62.05,15.1 61.55,15.6 60.55,15.6 60.1,15.15 60.05,10.15
  pour Route2 (isolate 0.4, rank 4, no thermals): 84,31.6 53.8,31.6 52.6,30.4 52.6,24.2 46.6,18.2 46.6,13.6 50.6,9.8 70.4,9.8 70.8,10.2 71.8,10.2 73,9 74.6,9 75,8.6 76.2,8.6 77,9.4 77.8,9.4 77.8,8.35 78.4,8.35 78.4,9.4 79.2,10.2 81.8,10.2 82.8,9.2 84.4,9.2 85,9.8 85,30.6
  cutout Route2 (isolate 0.2, rank 5, no thermals): 61.45,12 arc-180 62.25,12 arc-180
  pour Top (isolate 0.2, no thermals): 84.6,28.65 84.6,29.55 84.45,29.7 84.45,31.9 84.15,32.2 83.95,32.2 83.65,31.9 83.65,29.75 83.45,29.55 83.45,29.25 84.2,28.5 84.45,28.5
  pour Top (isolate 0.2, no thermals): 47.4,17.2 47,16.8 47,16 47.7,15.3 47.7,14.25 47.75,14.2 48.4,14.2 48.45,14.25 48.45,15.3 49,15.85 49,18 48.8,18.2 48,18.2 47.4,17.6
+5.0V  (via drill 0.3)
  Top 0.3: R48.2 85.2,8.75 v85.2,8.2
  Bottom 0.3: D6.C 59.9,6.4 v60,6.4 60.4,6.4 62.4,4.4 63.5,4.4 64.2,3.7 64.2,2.6 65.5,1.3 68.7,1.3 69.95,2.55 74.8,2.55 75.35,2 82.65,2 84,3.35 84,4 85.6,5.6 85.6,7.8 v85.2,8.2 85.2,10.6 84.8,11 84.2,11 83.8,11.4 83.8,13.25 85.1,14.55 85.1,23.3 86.05,24.25 86.05,27 84.95,28.1 83.8,28.1 82.45,29.45 82,29.45 81.7,29.75 R43.1
  other vias: 60,7.2 59.4,6.8
  pour Top (isolate 0.2, no thermals): 60.4,2.75 60.4,4 60.8,4.4 60.8,6 61.1,6.3 63.75,6.3 64.6,7.15 64.6,7.6 65.4,8.4 65.4,9.1 64.5,9.1 64.5,10.65 64.15,11 62.3,11 62.3,8.05 62.05,7.8 60.05,7.8 59.2,6.95 59.2,3.15 59.6,2.75
+5.0V-POE  (via drill 0.3)
  Top 0.4: Q7.1 61.9,3.2 v61.45,3.2
  Bottom 0.4: R47.1 v61.45,3.2 D6.A
  Bottom 1.1: C25.1 56.15,7.25 56.15,7
  Bottom 1.6: C20.2 49.9,1.1 54.45,1.1 56.15,2.8 | 56.15,2.8 56.15,3.95 | 56.15,3.95 D5.C | DC1.7 56.15,6.1 | 56.15,7 56.15,6.1 | 56.15,6.1 56.15,3.95 | 56.15,2.8 59.5,2.8 D6.A
BSB+
  Bottom 0.4: 13.45,30.05 D3.2 R10.2 | OK2.5 24.1,27.9 24.1,31.1 23.35,31.85 19.2,31.85 18.95,31.6 | R2.1 18.95,31.6 | 18.95,31.6 18.7,31.85 14.85,31.85 14.6,31.6 14.6,30.6 14.05,30.05 13.45,30.05 | 13.45,30.05 Q1.3
BSB-  (via drill 0.3)
  Top 0.4: ACT.C 4.1,20.3 5.4,21.6 5.8,21.6 8.7,24.5 v12.5,24.5
  Bottom 0.4: D2.A 11.25,23.25 v12.5,24.5 R7.1 Q1.2
BSB-RX-A  (via drill 0.3)
  Top 0.4: v21.25,30.8 21.84,30.8 OK1.1
  Bottom 0.4: R2.2 20.75,30.8 v21.25,30.8
BSB-RX-K
  Top 0.4: OK1.2 22.65,27.35 21.4,28.6 21.4,29.4 20.45,30.35 16.35,30.35 14,28 14,24.2 13.35,23.55 8.95,23.55 6.2,20.8 5.8,20.8 5.6,20.6 ACT.A
BSB-RXD  (via drill 0.3)
  Top 0.2: ESP1.4 81.5,31.7 v81.2,32 | v35.05,31.45 35.05,30.95 34.3,30.2 33.5,30.2 33.3,30 33.3,28.75 33.65,28.4 34.8,28.4 35,28.2 35,26.9 34.8,26.7 33.64,26.7 OK1.4
  Bottom 0.2: v81.2,32 81,32.2 78.4,32.2 78,31.8 52.2,31.8 51.75,32.25 44.65,32.25 44.25,31.85 40.2,31.85 39.8,32.25 37.4,32.25 36.75,31.6 R5.1 35.55,30.8 | R4.1 35.55,30.8 | 35.55,30.8 35.05,31.3 v35.05,31.45
BSB-TX-B
  Bottom 0.4: OK2.6 22.75,29.6 18.25,29.6 17.45,30.4 R1.2
BSB-TX-E
  Bottom 0.4: 14.75,25.8 14.75,27.6 | Q1.1 14.75,27.6 | 14.75,27.6 14.75,28.75 15.75,29.75 R1.1 | OK2.4 22.75,24.2 16,24.2 14.75,25.45 14.75,25.8 | 14.75,25.8 R7.2
BSB-TXD  (via drill 0.3)
  Top 0.2: ESP1.26 70.07,11.82 v70,11.75 | v57.8,22.8 v57.8,30.4
  Bottom 0.2: v70,11.75 70,12.8 69.4,13.4 62.6,13.4 57.8,18.2 v57.8,22.8 | v57.8,30.4 56.8,31.4 52,31.4 51.55,31.85 44.85,31.85 44.45,31.45 42.5,31.45 42.2,31.15 42.2,31 | R6.2 39.85,31 42.2,31 | 42.2,31 R8.2
CH340-!CTS
  Bottom 0.2: R50.2 74.6,3.5 IC6.5
CH340-!DTR
  Bottom 0.2: IC6.6 74.6,7.05 | R50.1 74.6,6.05 74.6,7.05 | 74.6,7.05 78.8,7.05 78.8,6.85 | Q5.2 78.8,6.85 | 78.8,6.85 78.8,6.35 78.1,5.65 R46.2
CH340-!RTS
  Bottom 0.2: IC6.4 75.1,2.95 75.6,2.45 78.25,2.45 80.4,4.6 80.95,4.6 81.2,4.85 R45.2 82.15,6.25 82.5,6.25 Q6.2
CH340-TXD
  Bottom 0.2: R49.1 77.4,10.2 76.8,10.2 75.6,9 IC6.8
CON-BSB+
  Bottom 0.4: BSB.1 4.65,28.66 R10.1
CON-BSB-
  Bottom 0.4: BSB.2 4.65,23.59 R9.1
EMAC-CLKOUT  (via drill 0.3)
  Top 0.2: ESP1.28 72.61,13.99 v72.4,14.2 | IC1.5 43.2,23.95 v43.2,23.6
  Bottom 0.2: v72.4,14.2 72,14.6 63.2,14.6 59,18.8 59,23.2 57,25.2 48.8,25.2 48.6,25 47.4,25 46.4,24 44.8,24 44.4,23.6 v43.2,23.6
EMAC-MDC  (via drill 0.3)
  Top 0.2: ESP1.37 84.04,13.56 83.45,14.15 82.8,14.15 82.6,14.35 v82.6,14.7 | IC1.17 40.8,29.36 v40.8,29.75
  Bottom 0.2: v82.6,14.7 82.35,14.95 78.25,14.95 77.9,15.3 76.5,15.3 75.6,16.2 64,16.2 60.6,19.6 60.6,24 57.8,26.8 48,26.8 47.8,26.6 44.6,26.6 41.6,29.6 40.95,29.6 v40.8,29.75
EMAC-MDIO  (via drill 0.3)
  Top 0.2: ESP1.30 75.15,13.85 v74.75,14.25 | v48.6,29.2 48.2,29.2 47.75,29.65 47.75,29.95 47,30.7 46.1,30.7 45.6,30.2 45.2,30.2 44.45,30.95 43.1,30.95 41.6,29.45 41.6,29.27 IC1.16
  Route2 0.2: v74.75,14.25 74.75,15.05 v73,16.8
  Bottom 0.2: v73,16.8 72.8,16.6 64.2,16.6 61,19.8 61,24.2 58,27.2 50.2,27.2 49.8,27.6 49.4,27.6 48.6,28.4 RN2.4 v48.6,29.2
EMAC-RX-CRSDV  (via drill 0.3)
  Top 0.2: ESP1.12 71.34,29.46 v71.6,29.2 | v49.4,29.2 49.4,28.8 49.2,28.6 48.2,28.6 47.3,29.5 47.3,29.8 46.8,30.3 46.3,30.3 45.8,29.8 45,29.8 44.25,30.55 43.3,30.55 42.05,29.3 42.05,29.02 IC1.15
  Bottom 0.2: v71.6,29.2 71.4,29 71.4,28.4 70.6,27.6 50.4,27.6 50,28 49.75,28 49.4,28.35 RN2.3 v49.4,29.2
EMAC-RXD0  (via drill 0.3)
  Top 0.2: ESP1.10 73.88,29.68 v73.8,29.6 | IC1.11 43.36,27.5 44,27.5 44.7,28.2 49.6,28.2 50.2,28.8 v50.2,29.2
  Bottom 0.2: v73.8,29.6 73.65,29.6 73.05,29 72.5,29 72.2,29.3 72.2,29.6 72,29.8 71.4,29.8 71,29.4 71,28.6 70.4,28 50.6,28 50.2,28.4 RN2.2 v50.2,29.2
EMAC-RXD1  (via drill 0.3)
  Top 0.2: ESP1.11 72.61,29.79 v72.8,29.6 | IC1.10 43.67,27.1 44.2,27.1 44.9,27.8 49.8,27.8 51,29 v51,29.2
  Bottom 0.2: v72.8,29.6 72.2,30.2 71.2,30.2 70.6,29.6 70.6,28.8 70.2,28.4 51,28.4 RN2.1 v51,29.2
EMAC-TXD0  (via drill 0.3)
  Top 0.2: ESP1.31 76.42,13.78 v75.95,14.25 | v37.65,28.15 37.59,28.15 IC1.22
  Bottom 0.2: v75.95,14.25 75.8,14.4 75.8,14.8 75.2,15.4 63.6,15.4 59.8,19.2 59.8,23.6 57.4,26 48.4,26 48.2,25.8 44.2,25.8 41.2,28.8 40.4,28.8 39,27.4 38.35,27.4 37.6,28.15 v37.65,28.15
EMAC-TXD1  (via drill 0.3)
  Top 0.2: ESP1.36 82.77,13.53 v81.9,14.4 | v37.5,27.4 37.63,27.4 IC1.23
  Bottom 0.2: v81.9,14.4 81.1,13.6 75.8,13.6 75.35,14.05 75.35,14.65 75,15 63.4,15 59.4,19 59.4,23.4 57.2,25.6 48.6,25.6 48.4,25.4 44,25.4 41,28.4 40.6,28.4 39.2,27 38.15,27 37.75,27.4 v37.5,27.4
EMAC-TXEN  (via drill 0.3)
  Top 0.2: ESP1.33 78.96,13.64 v78.3,14.3 | v38.4,28.2 38.4,28.05 IC1.21
  Bottom 0.2: v78.3,14.3 77.7,14.9 76.3,14.9 75.4,15.8 63.8,15.8 60.2,19.4 60.2,23.8 57.6,26.4 48.2,26.4 48,26.2 44.4,26.2 41.4,29.2 40.2,29.2 38.8,27.8 38.55,27.8 38.4,27.95 v38.4,28.2
ESP-BUTTON  (via drill 0.3)
  Top 0.2: v78.85,29.55 78.96,29.66 ESP1.6 | v75.85,10.8 75.85,10.15 | R34.1 74.35,10.15 | U2.3 75.85,10.15 | 75.85,10.15 74.35,10.15 | 74.35,10.15 OPT.1
  Bottom 0.2: v78.85,29.55 78.95,29.55 78.95,28.65 79.15,28.45 79.15,27.85 79.8,27.2 82.6,27.2 83,26.8 83,24.8 83.4,24.4 83.8,24.4 84.2,24 84.2,14.9 81.9,12.6 79.8,12.6 79,11.8 77.8,11.8 77.4,11.4 76.45,11.4 v75.85,10.8
ESP-BUTTON-R
  Bottom 0.2: OPT.2 70.15,10.6 67.95,10.6 R35.1
ESP-EN  (via drill 0.3)
  Top 0.2: v82.2,28.4 82.77,28.97 ESP1.3 82.77,31.97 v82.8,32 | U2.1 77.9,10.2 82.95,10.2 v83.35,10.6
  Top 0.3: RST.2 82.9,6.75 v83.95,7.8
  Bottom 0.2: v82.2,28.4 82.4,28.2 83,28.2 83.6,27.6 84.8,27.6 85.6,26.8 85.6,24.6 84.6,23.6 84.6,14.7 83.35,13.45 v83.35,10.6 83.35,10.1 R28.1 83.25,8.75 Q6.3 83.45,8.3 v83.95,7.8 | C1.1 82.8,30.75 v82.8,32
ESP-GPIO0  (via drill 0.3)
  Top 0.2: v78.2,11.25 78.05,11.4 70.6,11.4 70.4,11.2 69.3,11.2 v68.8,11.7 ESP1.25
  Bottom 0.2: Q5.3 79.95,10.35 80.2,10.6 81.4,10.6 82,11.2 82,12 81.8,12.2 80,12.2 79.2,11.4 78.35,11.4 v78.2,11.25 | R51.1 68.2,12.3 v68.8,11.7
ESP-RXD  (via drill 0.3)
  Top 0.2: v80.2,11.6 80.23,11.63 ESP1.34
  Bottom 0.2: R49.2 78.8,10.4 79.8,11.4 80,11.4 v80.2,11.6
ESP-SCL
  Top 0.2: UEXT.5 53.73,18.13 52.6,17 52.6,16 53.2,15.4 54.6,15.4 55.2,14.8 55.2,13.4 55.8,12.8 56.8,12.8 57.4,13.4 57.4,15.4 57.8,15.8 57.8,17.2 58.2,17.6 63.8,17.6 65.4,16 65.4,15.4 66,14.8 70.6,14.8 71.34,14.06 ESP1.27
  Bottom 0.2: RN4.2 52.4,16 52.6,16.2 52.6,17 53.73,18.13 UEXT.5
ESP-SD-CLK  (via drill 0.3)
  Top 0.2: ESP1.13 70.07,29.87 v69.6,29.4 67.6,29.4 67.4,29.6 66.8,29.6 62.2,25 62.2,21.8 60.4,20 53.2,20 52.6,19.4 52.6,17.6 52.2,17.2 52.2,15.8 53.73,14.27 UEXT.9
  Bottom 0.2: v69.6,29.4 69.6,30 70.6,31 74.2,31 74.6,30.6 76.95,30.6 R33.1
ESP-SD-CMD  (via drill 0.3)
  Top 0.2: v69.9,20.4 69.2,20.4 68.8,20 68.8,17.6 68.56,17.36 ESP1.23 66.05,17.36 65.8,17.6 65.8,18.6 65.6,18.8 57.6,18.8 56.8,18 55.27,18 UEXT.7
  Bottom 0.2: USD.3 79.4,19.4 78.6,20.2 69.9,20.2 | R32.1 69.3,19.7 69.8,20.2 69.9,20.2 | 69.9,20.2 v69.9,20.4
ESP-SD-DATA  (via drill 0.3)
  Top 0.2: ESP1.24 66.56,16.09 65.25,17.4 v65.25,18.15 65,18.4 57.8,18.4 56.27,16.87 UEXT.8
  Bottom 0.2: R31.1 75.75,27.35 75.2,26.8 75.2,26 74.4,25.2 65.2,25.2 63.6,23.6 63,23.6 62.8,23.4 62.8,21.4 63,21.2 63.6,21.2 64.6,20.2 64.6,19.6 65.25,18.95 RN3.4 v65.25,18.15 | R51.2 66.9,13 62.4,13 60,15.4 57.33,15.4 UEXT.8
ESP-SDA
  Top 0.2: ESP1.16 65.84,26.25 63.4,23.8 63.4,21 61.8,19.4 56.67,19.4 UEXT.6
  Bottom 0.2: RN4.3 52.2,15.2 52.4,15.4 54.2,15.4 54.8,16 54.8,17.53 UEXT.6
ESP-SSEL
  Top 0.2: UEXT.10 56.27,14.87 57.4,16 57.4,17.4 58,18 64,18 65.8,16.2 65.8,15.6 66.2,15.2 72.4,15.2 73.2,14.4 73.2,14.2 73.88,13.52 ESP1.29
  Bottom 0.2: RN4.4 52,14.4 52.6,15 55.19,15 UEXT.10
ESP-TXD  (via drill 0.3)
  Top 0.2: v81.4,11.6 81.5,11.7 ESP1.35
  Bottom 0.2: IC6.9 76.1,8.9 76.9,9.7 79.1,9.7 79.4,10 79.4,10.4 80,11 81.2,11 81.4,11.2 v81.4,11.6
ETH-LED1  (via drill 0.3)
  Top 0.2: IC1.3 42.54,23.2 42.8,23.2 v43.2,22.8
  Bottom 0.2: POE-ETH.11 3.4,14.89 3.4,13.8 4.4,12.8 7.2,12.8 8,13.6 10.3,13.6 11,12.9 12.9,12.9 14.2,14.2 15.4,14.2 21.4,20.2 36.8,20.2 40.2,23.6 42.2,23.6 42.6,23.2 42.8,23.2 v43.2,22.8
ETH-LED1-K
  Bottom 0.2: R29.1 1.95,13.8 POE-ETH.12
ETH-LED2  (via drill 0.3)
  Top 0.2: IC1.2 42.45,22.58 v42.45,22.5
  Bottom 0.2: POE-ETH.14 3.4,5 3.4,10.2 4.6,11.4 7.2,11.4 7.6,11 11.4,11 11.6,10.8 12.6,10.8 13.85,12.05 15.4,12.05 15.85,12.5 15.85,14.05 21.6,19.8 37,19.8 40.4,23.2 42,23.2 42.45,22.75 v42.45,22.5
ETH-LED-G-A
  Bottom 0.2: R30.1 1.95,6.09 POE-ETH.13
ETH-PHYAD0  (via drill 0.3)
  Top 0.2: IC1.13 42.6,28.15 42.6,29 v42.85,29.25
  Bottom 0.2: v42.85,29.25 42.95,29.35 43.65,29.35 43.9,29.1 44.6,29.1 RN1.4
ETH-PHYAD1  (via drill 0.3)
  Top 0.2: IC1.7 43.67,24.9 44.5,24.9 46.7,27.1 v46.7,27.2
  Bottom 0.2: v46.7,27.2 46.7,27.8 47,28.1 RN1.1
ETH-PHYAD2  (via drill 0.3)
  Top 0.2: IC1.8 43.92,25.35 44.35,25.35 45.95,26.95 v45.95,27.2
  Bottom 0.2: v45.95,27.2 45.95,27.75 46.2,28 RN1.2
ETH-PWR-B  (via drill 0.3)
  Top 0.2: R11.1 v49.65,22.95 R14.2
  Bottom 0.2: Q3.1 49.65,22.35 v49.65,22.95
ETH-PWR-C
  Bottom 0.2: Q3.3 R12.1
ETH-PWR-G  (via drill 0.3)
  Top 0.2: C4.2 R13.1 49.55,16.3 v49.55,18.05 49,18.6 47.8,18.6 47.05,17.85 Q4.1
  Bottom 0.2: v49.55,18.05 49.3,18.3 R12.2
ETH-RBIAS
  Top 0.2: IC1.32 40.2,22.93 40.2,21.4 R20.2
ETH-RD_N
  Top 0.175: POE-ETH.2 12.95,14.39 13.23,14.68 13.23,15.04 12.84,15.43 12.84,16.27 14.33,17.76 16.73,17.76 17.38,18.41 18.45,18.41 | 18.45,18.41 19.28,18.41 20.18,19.31 22.68,19.31 23.33,19.96 35.93,19.96 36.78,20.81 37.73,20.81 38.7,21.78 | 38.7,21.78 R17.1 | IC1.30 39.44,23.57 39.44,23.46 38.94,22.97 38.94,22.02 38.7,21.78 | U1.3 18.45,18.41
ETH-RD_P
  Top 0.175: POE-ETH.1 14.32,15.3 13.43,15.3 13.16,15.57 13.16,16.13 14.47,17.44 16.87,17.44 17.52,18.09 19.42,18.09 20.32,18.99 21.05,18.99 | 21.05,18.99 22.82,18.99 23.47,19.64 36.07,19.64 36.92,20.49 37.87,20.49 38.93,21.55 | 38.93,21.55 R18.2 | IC1.31 39.8,23.23 39.66,23.23 39.26,22.83 39.26,21.88 38.93,21.55 | U1.4 21.05,18.99
ETH-RMIISEL  (via drill 0.3)
  Top 0.2: IC1.9 43.92,26.65 45.05,26.65 45.2,26.8 v45.2,27.2
  Bottom 0.2: v45.2,27.2 45.4,27.4 RN1.3
ETH-RST
  Top 0.2: R19.1 38.66,30.75 C12.1 IC1.19
ETH-SHLD
  Bottom 1.4: POE-ETH.SH2 8.6,2.21 8.6,5.6 9.1,6.1 C2.1
ETH-TD_N
  Top 0.175: POE-ETH.6 12.91,9.31 13.23,9.63 13.23,9.99 12.78,10.44 11.33,10.44 10.44,11.33 10.44,15.27 16.38,21.21 19.37,21.21 20.32,20.26 21.05,20.26 | 21.05,20.26 22.23,20.26 22.93,20.96 35.53,20.96 36.04,21.47 36.04,22.27 37.13,23.36 | 37.13,23.36 R15.1 | IC1.28 38.73,24.29 38.73,24.16 38.28,23.71 37.48,23.71 37.13,23.36 | U1.5 21.05,20.26
ETH-TD_P
  Top 0.175: POE-ETH.5 14.36,10.25 13.43,10.25 12.92,10.76 11.47,10.76 10.76,11.47 10.76,15.13 16.52,20.89 18.45,20.89 | 18.45,20.89 19.23,20.89 20.18,19.94 22.37,19.94 23.07,20.64 35.67,20.64 36.36,21.33 36.36,22.13 37.36,23.13 | 37.36,23.13 R16.2 | IC1.29 39.09,23.93 38.97,23.93 38.42,23.39 37.62,23.39 37.36,23.13 | U1.1 18.45,20.89
ETH-VDDA  (via drill 0.3)
  Top 0.5: R18.1 v38.35,20.2 | 37.08,21.53 v37.05,21.5 37.08,21.53 | R16.1 37.08,21.53 | R15.2 v35.75,22.8 | R17.2 37.08,21.53
  Route15 1: POE-ETH.4 12.71,11.86 13.97,13.12 POE-ETH.3 21.36,19.8 35.35,19.8 v37.05,21.5 | v37.05,21.5 v35.75,22.8 | v37.05,21.5 v38.35,20.2
  Bottom 0.2: R30.2 2.6,8.7 2.95,9.05 2.95,10.35 4.4,11.8 7.4,11.8 7.75,11.45 9.2,11.45 C3.1
  Bottom 0.9: POE-ETH.4 10.49,11.86 C3.1
  other vias: 40.9,22.5 37.9,24.3 41.6,22.5 37.4,24.8 43,18.7 43,17.9 43,17.1
  pour Top (isolate 0.2, no thermals): 42.2,21.2 42.2,22.4 41.2,23.4 40.8,23.4 40.4,23 40.4,21.2
  pour Top (isolate 0.2, no thermals): 36,24.6 37,23.6 37.8,23.6 39,24.8 38.6,25.2 38.45,25.05 36.95,25.05 36.6,25.4 36,25.4
  pour Top (isolate 0.2, no thermals): 42.6,16.8 42.6,18.8 42.8,19 43.2,19 44,18.2 45.6,18.2 45.6,16.8 45.4,16.6 42.8,16.6
  pour Route15 (isolate 0.4, no thermals): 42.2,16.6 39.4,19.4 34.2,19.4 34.2,20.2 35.2,21.2 35.2,23.4 36.8,25 37.8,25 39.8,23 41.6,23 44,20.6 44,17 43.6,16.6
ETH-VDDCR  (via drill 0.3)
  Top 0.25: IC1.6 43.66,24.2 v43.8,24.2
  Top 0.6: C7.1 C10.1 44,24 v43.8,24.2
ETH-VDDIO  (via drill 0.3)
  Top 0.25: IC1.12 43.2,28.05
  Top 0.5: C11.1 43.7,28.4 | 43.7,28.4 v43.4,28.7 43.2,28.5 43.2,28.05 43.65,28.05 v43.85,28.25 43.7,28.4 | v45.75,31.2 45.4,31.2 v45.15,31.2 | 50.7,30.65 v50.7,30.4 | v37.5,29.8 R19.2
  Top 1: 47.4,20.05 C5.1 47.4,25.4 48.2,26.2 50.4,26.2 52.9,28.7 52.9,29.7 51.95,30.65 50.7,30.65 49.5,30.65 48.45,31.7 45.9,31.7 45.4,31.2
  Route2 0.5: v37.5,29.8 38.2,29.8 39.8,28.2 39.8,27.2 40.2,26.8 41.5,26.8 v43.4,28.7
  Route15 0.5: v45.15,31.2 45.45,31.2 | 45.45,31.2 v45.75,31.2 | 45.45,31.2 45.45,30.95
  Route15 0.6: 43.85,28.7 v43.4,28.7 v43.85,28.25 43.85,28.7
  Route15 1: 43.85,28.7 45.45,30.3 45.45,30.95
  Bottom 0.4: RN2.8 50.7,30.35 | v50.7,30.4 50.7,30.35 | 50.7,30.35 RN2.7 RN2.6 RN2.5
  Bottom 0.5: RN1.6 45.4,31.2 | 45.4,31.2 v45.75,31.2 | 45.4,31.2 v45.15,31.2
  pour Top (isolate 0.2, rank 2, no thermals): 44,18.85 44,19.85 44.15,20 45.8,20 46.6,20.8 46.6,22.2 47,22.6 47.6,22.6 47.8,22.4 47.8,19.4 47.1,18.7 44.15,18.7
GND  (via drill 0.3)
  other vias: 76.2,24 77.6,24 79,24 79,22.6 77.6,22.6 76.2,22.6 76.9,21.9 78.3,21.9 78.3,24.7 78.3,23.3 76.9,23.3 76.9,24.7 11,19.8 19.45,19.7 17.7,19.65 14.95,18.45 17.3,13.85 9,13 17.15,11.85 7.95,14.65 0.75,0.85 5.95,0.85 3.75,0.85 0.75,7.25 0.75,12.45 0.75,9.65 19.85,16.6 13.8,19.8 15.2,21.2 20.15,21.4 9.8,14.8 4,17 4.2,14 6.6,13.4 43.8,12.2 46.8,12 48.6,10.2 49.4,8 49.4,5.4 51.6,2.8 53.8,2.8 53.8,3.6 53.8,4.4 51.6,4.4 51.6,3.6 53.8,8 57.6,8 57.4,0.6 58,5.4 58,4.1 66.4,9.9 61.6,9.5 60.1,9.5 66.55,11.8 59.35,9.5 60.85,9.5 5.95,10.65 4.15,7.65 11.95,17.85 74.45,1.8 80.9,4 77.8,3.2 68.4,3.6 72.45,1.8 78.3,4.5 77.9,6.35 77.25,8.85 73.55,8.5 62.55,5.3 61.8,2.25 71.25,0.65 81.85,0.6 85.8,0.6 85.8,4.6 85.9,9.85 85.8,31.6 85.8,30 84.8,26.6 85.8,22.8 85.8,18.6 85.8,13.4 85.8,12 64.2,0.6 82.65,11.3 80.2,14.3 67.8,32.4 77.05,32.45 72,32.45 82,32.45 81.5,29 78.35,28.95 61.6,4.25 77.05,14.3 77.6,16 52.6,32.4 56,32.4 63.8,32.4 59.6,32.4 73.7,28.8 13.8,9.4 9,10.4 3.6,12.4 3.4,15.8 0.75,15.25 13.8,14.7 12.15,15.65 76.75,10.85 80.95,1.3 65.75,6.8 78.95,8.8 83.45,4 65,3 74.55,5 70.4,4.8 66.4,4.4 67.55,8.5 66.4,9.25 70.95,8.5 85.8,30.8 85.2,32 82.4,26.45 80.4,22.6 83.4,15.2 74,14.3 84.6,24.6 85.8,28.2 83.6,23.6 83.6,18.2 80.2,25.8 64.8,23.6 68.8,24.6 70.2,24.6 72,24.6 70,18 72.2,18.8 65.4,27 68.8,27 61.8,20.4 63,19.6 61.6,22.2 67.1,29 67.1,30.6 58.6,16.4 58,12.8 54.6,12.8 52.4,13.6 51.8,17.8 52.8,20.6 55.2,20.6 58.4,20.6 65.2,14 63,27 59.5,14.55 59.2,27 66.4,10.6 60.05,16.85 37.55,28.95 41.55,30.2 39.4,29.8 37.3,26.4 37.3,25.7 40.8,26 42.4,26 40.8,27.6 39.2,26 40.8,24.4 41.1,20.2 38.6,18.5 45.3,23.25 45.2,24.65 45.1,21.45 22.2,18.4 27.4,18.5 33.4,18.5 25.2,21.5 29.6,21.5 34,21.5 37.65,31.35 44.8,15.9 48.4,19.2 50.4,17.9 48.4,21.1 50.5,24 48.6,24.3 42,15.8 43.8,14.1 46.4,15.3 48,13.5 50.4,13.5 65.25,12.4 55.2,29.1 53.9,29.1 57,29.1 58.6,29.1 58.6,30.9 56.6,30.7 54.4,30.7 43.6,32.45 29.8,32.4 29.8,28.65 29.8,24.25 27.8,22.25 33.2,23.3 34.4,32.4 82.05,5.2 79.4,4.5 76.45,28.9 58.4,22.2 61.6,25 63.2,25 73.9,26.3 75.1,10.8 69.2,9.75 11.35,13.5 16.05,10.85 11.1,9.9 15.2,16.8 2.75,7.15 4.2,9.8 9,12.2 47.85,30.7 43.75,29.95 46.55,29.7 47.5,27.2 46.2,24.65 51.8,29.2 52.1,24.4 45.5,20.65 46.1,22.65 41.1,19.5 41.4,16.4 40.8,17 42.8,15.8 50.7,21.4 40.5,32.45 67.8,14 79.45,2.8 77.25,4.2 73.9,4.15 72.9,5.35 84.85,7.4 84.05,2.4 84.45,5.4 81.1,8.45 70.2,7.6 73,6.4 71.6,3.4 70.25,1.65
  pour Top (isolate 0.2, rank 6, no thermals): 29.4,33 29.4,24.4 26.8,21.8 15,21.8 13.4,20.2 8.8,20.2 6,17.4 2,17.4 0,15.4 0,0 86.4,-0.2 86.4,33
  pour Bottom (isolate 0.2, rank 6, no thermals): 29.4,33 29.4,24.4 26.8,21.8 15,21.8 13.4,20.2 8.8,20.2 6,17.4 2,17.4 0,15.4 0,0 86.4,-0.2 86.4,33
  pour Route2 (isolate 0.4, rank 6, no thermals): 29.4,33 29.4,24.4 26.8,21.8 15,21.8 14.2,21 9.6,21 6,17.4 2,17.4 0,15.4 0,0 86.4,0 86.4,33
  pour Route15 (isolate 0.4, rank 6, no thermals): 29.4,33 29.4,24.4 26.8,21.8 15,21.8 14.2,21 9.6,21 6,17.4 2,17.4 0,15.4 0,0 86.4,0 86.4,33
  cutout Route15 (isolate 0.2, rank 2, no thermals): 15.2,9.2 17.6,11.6 17.8,11.4 15.4,9
  cutout Route2 (isolate 0.2, rank 2, no thermals): 15.2,9.2 17.6,11.6 17.8,11.4 15.4,9
N$2
  Bottom 0.2: R45.1 80.2,5.7 80.9,6.4 Q5.1
N$4
  Bottom 0.2: R46.1 79.1,5.45 80.05,6.4 80.05,7.55 80.25,7.75 81.85,7.75 82.2,7.4 83.45,7.4 Q6.1
PHY-PWR
  Top 0.2: ESP1.14 68.8,31.6 56.4,31.6 54.6,29.8 54.6,28 51.25,24.65 49.65,24.65 R14.1
POE-5V0
  Bottom 0.4: C19.1 R38.1 40.3,6.1 DC1.1
  Bottom 1: DC1.1 41.58,6.27 44.8,3.05 C20.1
  pour Top (isolate 0.3, no thermals): 37.5,11.7 28.2,11.7 28.2,16 38.2,16 41.2,13 41.2,10 41.6,9.6 42.6,9.6 42.6,5.6 42.05,5.05 39.55,5.05 38.15,6.45 38.15,11.05
POE-CLASS
  Bottom 0.4: IC2.2 23.48,2.45 R27.1
POE-DC-BS
  Top 0.4: IC3.8 35.95,5.21 35.95,6.4 R39.1
POE-DC-BS-RC
  Top 0.4: R39.2 C17.1
POE-DC-FB  (via drill 0.3)
  Top 0.4: IC3.5 36.4,1.4 v37.7,2.7
  Bottom 0.4: v37.7,2.7 R37.1 R36.1 38.85,4.55 C19.2
POE-DC-FBRT
  Bottom 0.4: R36.2 38.85,5.55 R38.2
POE-DC-ILIM  (via drill 0.3)
  other vias: 31.6,4 31.6,5 32.8,5 34,5 34,4 34,1.6 31.6,1.6 31.6,2.6 32.8,4 32.8,2.6 32.8,1.6 34,2.6
  pour Top (isolate 0.3, no thermals): 26.9,5.4 28.75,5.4 28.75,4.4 31,4.4 31.2,4.6 31.2,5.2 31.4,5.4 34.2,5.4 34.4,5.2 34.4,1.4 34.2,1.2 31.4,1.2 31.2,1.4 31.2,3.4 31,3.6 26.9,3.6
  pour Bottom (isolate 0.2, no thermals): 35.6,1.4 35.6,5.2 35.4,5.4 29.6,5.4 29.4,5.2 29.4,1.4 29.6,1.2 35.4,1.2
  pour Route15 (isolate 0.2, no thermals): 31.2,5.2 31.4,5.4 34.2,5.4 34.4,5.2 34.4,1.4 34.2,1.2 31.4,1.2 31.2,1.4
  pour Route2 (isolate 0.2, no thermals): 31.2,5.2 31.4,5.4 34.2,5.4 34.4,5.2 34.4,1.4 34.2,1.2 31.4,1.2 31.2,1.4
POE-DC-SW
  pour Top (isolate 0.3, rank 2, no thermals): 28.2,10.8 28.2,4.4 32.8,4.4 32.8,7.4 33.2,7.8 37,7.8 37.4,8.2 37.4,10.6 37.2,10.8
POE-DET
  Bottom 0.4: R25.2 19.35,5.95 19.9,5.4 21.85,5.4 22.21,5.04 IC2.3
POE-GND  (via drill 0.3)
  other vias: 24.6,5.6 25.4,5.6 26.2,5.6 26.2,4.8 26.2,4 20.2,8.2 20.2,7.4 21.8,7.4 20.2,6.6 21.8,6.6 22.8,12 23.8,12 24.8,12 24.8,15 23.8,15 22.8,15 24.8,13.4 22.8,13.4 20.2,12.6 27.4,6.8 27.4,9.4 27.4,12 27.4,15.6 46.4,8.2 46.4,4.8 35.8,0.6 36.6,0.6 44.4,0.6 41.6,0.6 39.2,0.6 39.4,3.4 42.2,3.8 44.8,9.2 25.4,6.4 24.6,6.4 25.4,7.2 24.6,7.2 25.8,10.4 26.6,10.4 27.4,10.4 27.4,8.4 27.4,7.6 23.8,7.2 23.8,6.4 23.8,5.6 22.6,6.6 22.6,7.4
  pour Top (isolate 0.2, rank 3, no thermals): 17,8.1 19.6,10.7 19.6,12.9 22.7,16 38.2,16 41.2,13 41.2,10 41.6,9.6 45.6,9.6 46.8,8.4 46.8,0.3 17,0.3
  pour Bottom (isolate 0.2, rank 3, no thermals): 19,8.7 19.6,9.3 19.6,12.9 22.7,16 38.2,16 41.2,13 41.2,10 41.6,9.6 45.6,9.6 46.8,8.4 46.8,0.3 19,0.3
  pour Route2 (isolate 0.4, rank 3, no thermals): 19,10.1 19.6,10.7 19.6,12.9 22.7,16 38,16 41.2,12.8 41.2,10 41.6,9.6 45.6,9.6 46.8,8.4 46.8,0.3 19,0.3
  pour Route15 (isolate 0.4, rank 3, no thermals): 19,10.1 19.6,10.7 19.6,12.9 22.7,16 38,16 41.2,12.8 41.2,10 41.6,9.6 45.6,9.6 46.8,8.4 46.8,0.3 19,0.3
POE-ILIM
  Bottom 0.4: IC2.1 24.75,2.45 R26.1
POE-PG  (via drill 0.3)
  Top 0.4: v36.3,2.65 35.65,2.65 IC3.6
  Route15 0.4: v22.2,8.35 22.35,8.2 25.8,8.2 26.4,7.6 26.4,6.55 28.6,4.35 28.6,1 29,0.6 34.6,0.6 35.2,1.2 35.2,2.2 35.65,2.65 v36.3,2.65
  Bottom 0.4: IC2.6 v22.2,8.35
POE-UVLO
  Bottom 0.4: R23.1 27,6 26.6,6.4 26.6,8.15 R24.2 24.05,8.35 23.48,8.91 IC2.7
POE-V+
  Bottom 0.4: R24.1 24.75,9.35 IC2.8
  Bottom 0.6: 18.35,7.9 R25.1 18.35,9.15 19.8,10.6 19.8,11 20,11.2 24.2,11.2 24.75,10.64 IC2.8
  pour Top (isolate 0.3, rank 2, no thermals): 12.4,6.1 14.2,6.9 16.4,6.9 19.6,3.7 22.7,3.7 23.3,3.1 30.6,3.1 30.6,2.2 29,2.2 28.8,2 28.8,0.3 13.2,0.3 12,1.5 12,3.2 11.4,3.8 11.4,4.4 12.4,5.4
  pour Bottom (isolate 0.3, no thermals): 18.6,4.9 18.6,9 20,10.4 20,10.6 19.5,10.6 15.8,6.9 14.2,6.9 12.8,6.3 14.1,5 14.1,3.4 15,3.4 16.5,4.9
POE-V-
  pour Bottom (isolate 0.3, rank 2, no thermals): 11.4,4.5 12.6,5.7 14.7,3.6 15,3.6 16.1,4.7 25,4.7 25,2.7 27.25,2.7 27.25,0.3 13.2,0.3 11.4,2.1
PWR-LED
  Top 0.3: PGD.A R48.1
PWR-SNS  (via drill 0.3)
  Top 0.2: ESP1.5 80.23,29.78 v80.2,29.75
  Bottom 0.3: R43.2 C27.1 v80.2,29.75 80.2,29.55 R44.1
RXD-B  (via drill 0.3)
  Top 0.2: OK1.6 31.75,30.1 v33.1,31.45
  Bottom 0.2: v33.1,31.45 R4.2
SD-DAT0
  Bottom 0.2: USD.7 80.6,23.8 77.2,27.2 R31.2
SD-DAT1
  Bottom 0.2: RN3.3 66.05,17.85 65.8,17.6 64.8,17.6 64.6,17.8 64.6,19 64.2,19.4 64.2,20 63.4,20.8 62.8,20.8 62.4,21.2 62.4,23.6 62.8,24 63.4,24 65,25.6 74.2,25.6 74.8,26.2 74.8,27 75.8,28 77.65,28 77.8,27.85 77.8,27.2 80.1,24.9 USD.8
SD-DAT2
  Bottom 0.2: USD.1 80.4,17.2 78.2,19.4 70.2,19.4 70.05,19.25 70.05,19.05 69.6,18.6 68.8,18.6 68.2,18 67.2,18 66.85,18.35 RN3.2
SD-DAT3
  Bottom 0.2: USD.2 79.9,18.3 78.4,19.8 70,19.8 69.65,19.45 69.65,19.25 69.4,19 67.65,19 RN3.1
SD-SCLK
  Bottom 0.2: R33.2 77.5,28.75 78.2,28.05 78.2,27.4 79.2,26.4 81.6,26.4 82.55,25.45 82.55,23.5 82.8,23.25 82.8,22 82.4,21.6 USD.5
SD-VCC
  Bottom 0.8: USD.4 79.5,20.5 79,21 70.55,21 69.55,22 C16.1 C15.1 66.15,22 L2.2
TVS-BSB-
  Bottom 0.4: R9.2 7.1,21.95 D2.C 8.15,24.1 D3.1
TXD-A
  Bottom 0.2: OK2.1 31.75,28.8 R3.2
TXD-B  (via drill 0.3)
  Top 0.2: v39.6,31.6 39,32.2 37.4,32.2 35.5,30.3 35,30.3 Q2.B
  Bottom 0.2: R6.1 38.85,31.25 39.2,31.6 v39.6,31.6
TXD-C  (via drill 0.3)
  Top 0.2: v36,29.1 36.1,29 36.1,28.65 Q2.C
  Bottom 0.2: R3.1 35.8,29.1 v36,29.1
UEXT-RX  (via drill 0.3)
  Top 0.2: ESP1.8 76.42,30.02 v75.8,29.4 | UEXT.4 56.61,21.2 59.8,21.2 61,22.4 61,25.6 v61.2,25.8
  Bottom 0.2: v75.8,29.4 72.4,26 61.4,26 v61.2,25.8 | RN4.1 51.8,16.8 52.6,17.6 52.6,19.4 53.2,20 53.65,20 55.19,21.54 UEXT.4
UEXT-TX  (via drill 0.3)
  Top 0.2: ESP1.9 75.15,29.6 v75.05,29.5 | UEXT.3 54.74,21.54 55.8,22.6 56.6,22.6 57.6,21.6 59.6,21.6 60.6,22.6 v60.6,26.4
  Bottom 0.2: v75.05,29.5 75.05,29.25 72.2,26.4 v60.6,26.4
USB-D+  (via drill 0.3)
  Top 0.2: 76.55,4.8 USB.D+ 76.55,6.3 v76.7,6.45 77.2,6.95 77.75,6.95 U2.5
  Bottom 0.2: IC6.1 76.6,6.35 v76.7,6.45
USB-D-  (via drill 0.3)
  Top 0.2: 75.9,5 USB.D- 75.9,6.5 v75.95,6.45 75.95,7.35 U2.4
  Bottom 0.2: IC6.2 76.1,6.3 v75.95,6.45
USB-VBUS
  Top 0.4: USB.VBUS 75.25,6.6 75.05,6.6
  Top 0.8: 75.05,6.6 74.25,7.4 72,7.4 71.4,6.8 71.4,4.55 68.6,1.75 63.75,1.75 63.15,1.15 Q7.3

### Text on the board
tPlace: (w/o UART) | B+ | Open / Hardware | B- | BSB-LAN / ESP32 PoE | T Carpenter V1.1 Apr25 | Isolated / Supply
bPlace: JLCJLCJLC | Based on: / Olimex ESP32-POE-ISO / Fredlcore BSB-LAN | github://TCWORLD/BSB-LAN-CircuitBoard / github://fredlcore/BSB-LAN / github://OLIMEX/ESP32-POE-ISO